# Altium project Quadrocopter.PrjPcb (part 1 of 2)
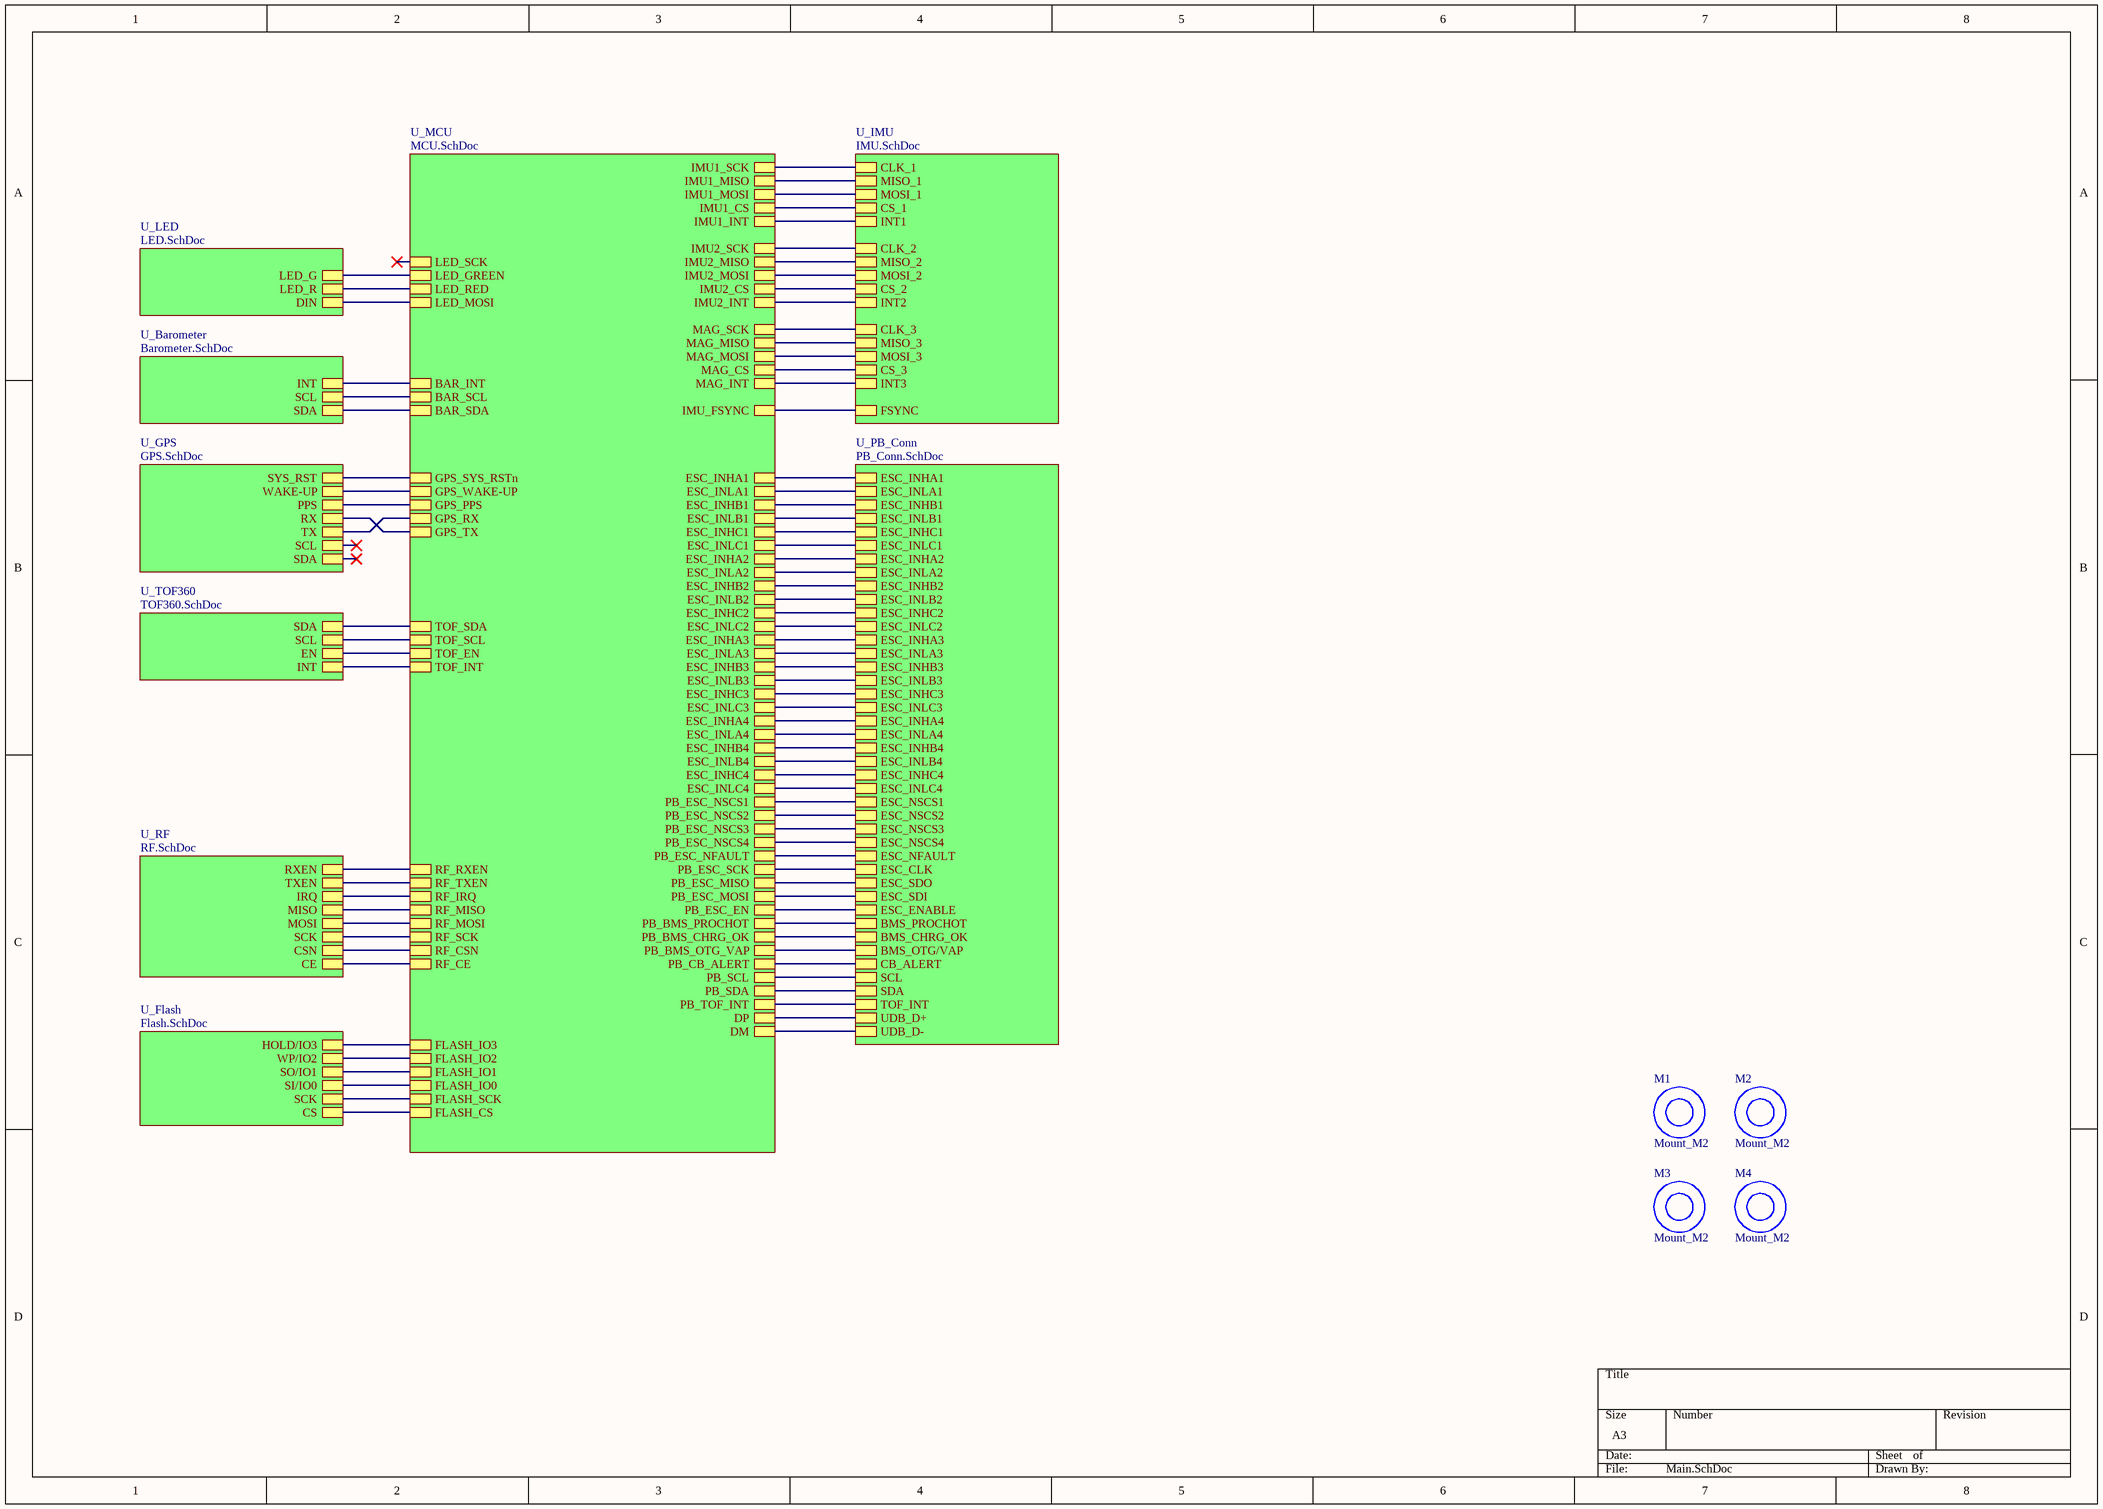
[diagram p0: Main.SchDoc]
11 sheets, 269 parts. Net scope: hierarchical (ports join the sheet entries above them; power ports are global).
Sheets:
  Main.SchDoc
    U_MCU = MCU.SchDoc
    U_IMU = IMU.SchDoc
    U_RF = RF.SchDoc
      U_NRF24l01 = NRF24l01.SchDoc
  ESC.SchDoc
  USB.SchDoc
  PDN.SchDoc
    U_PSU = PSU.SchDoc
    U_BMS = BMS.SchDoc
  ToF.SchDoc

## Sheet Main.SchDoc
size A3; SheetNumber: 1; SheetTotal: 12

### Parts
M1  Mount_M2  [Mount_M2]
M2  Mount_M2  [Mount_M2]
M3  Mount_M2  [Mount_M2]
M4  Mount_M2  [Mount_M2]

### Sub-sheets
U_Barometer = Barometer.SchDoc (file not in this document): SDA, SCL, INT
U_Flash = Flash.SchDoc (file not in this document): CS, SO/IO1, WP/IO2, HOLD/IO3, SCK, SI/IO0
U_GPS = GPS.SchDoc (file not in this document): SDA, SCL, TX, RX, PPS, WAKE-UP, SYS_RST
U_IMU = IMU.SchDoc: INT1, INT2, MISO_1, MOSI_1, CS_1, CLK_1, FSYNC, MISO_2, MOSI_2, CS_2, CLK_2, MOSI_3, CS_3, CLK_3, MISO_3, INT3
U_LED = LED.SchDoc (file not in this document): DIN, LED_R, LED_G
U_MCU = MCU.SchDoc: DP, DM, TOF_SDA, TOF_SCL, TOF_EN, TOF_INT, ESC_INHA1, ESC_INHA2, ESC_INHA3, ESC_INHA4, ESC_INHB1, ESC_INHC1, ESC_INHB2, ESC_INHB3, ESC_INHB4, ESC_INHC2, ESC_INHC3, ESC_INHC4, ESC_INLA1, ESC_INLB1, ESC_INLC1, ESC_INLA2, ESC_INLA3, ESC_INLA4, ESC_INLB2, ESC_INLB3, ESC_INLB4, ESC_INLC2, ESC_INLC3, ESC_INLC4, RF_IRQ, RF_CSN, RF_MOSI, RF_MISO, RF_SCK, RF_CE, RF_RXEN, RF_TXEN, PB_SCL, PB_SDA, PB_TOF_INT, PB_ESC_EN, PB_ESC_SCK, PB_ESC_MISO, PB_ESC_MOSI, PB_ESC_NSCS1, PB_ESC_NSCS2, PB_ESC_NSCS3, PB_ESC_NSCS4, PB_BMS_PROCHOT, PB_BMS_OTG_VAP, PB_BMS_CHRG_OK, PB_CB_ALERT, PB_ESC_NFAULT, FLASH_IO0, FLASH_IO1, FLASH_IO2, FLASH_IO3, FLASH_SCK, FLASH_CS, GPS_RX, GPS_TX, GPS_PPS, GPS_WAKE-UP, GPS_SYS_RSTn, BAR_SCL, BAR_SDA, BAR_INT, LED_MOSI, LED_SCK, LED_RED, LED_GREEN, IMU1_SCK, IMU1_MISO, IMU1_MOSI, IMU1_CS, IMU1_INT, IMU2_INT, IMU2_SCK, IMU2_MISO, IMU2_MOSI, IMU2_CS, MAG_SCK, MAG_MISO, MAG_MOSI, MAG_CS, MAG_INT, IMU_FSYNC
U_PB_Conn = PB_Conn.SchDoc (file not in this document): ESC_INLA1, ESC_INLB1, ESC_INLC1, ESC_INLA2, ESC_INLB2, ESC_INLC2, ESC_INLA3, ESC_INLB3, ESC_INLC3, ESC_INHA4, ESC_INLB4, ESC_INLC4, ESC_NSCS1, ESC_INHA1, ESC_INHB1, ESC_INHC1, ESC_INHA2, ESC_INHB2, ESC_INHC2, ESC_INHA3, ESC_INHB3, ESC_INHC3, ESC_INLA4, ESC_INHB4, ESC_INHC4, ESC_NSCS2, ESC_NSCS3, ESC_NSCS4, ESC_NFAULT, ESC_CLK, ESC_SDO, ESC_SDI, ESC_ENABLE, BMS_PROCHOT, BMS_CHRG_OK, BMS_OTG/VAP, CB_ALERT, SCL, SDA, TOF_INT, UDB_D+, UDB_D-
U_RF = RF.SchDoc: CE, CSN, SCK, MOSI, MISO, IRQ, TXEN, RXEN
U_TOF360 = TOF360.SchDoc (file not in this document): INT, SCL, SDA, EN

### Nets
I2C1_SCL: sheet U_MCU/TOF_SCL, sheet U_TOF360/SCL
I2C1_SDA: sheet U_MCU/TOF_SDA, sheet U_TOF360/SDA
SPI1_MISO: sheet U_MCU/IMU1_MISO, sheet U_IMU/MISO_1
SPI1_MOSI: sheet U_MCU/IMU1_MOSI, sheet U_IMU/MOSI_1
SPI1_SCK: sheet U_MCU/IMU1_SCK, sheet U_IMU/CLK_1
SPI5_MISO: sheet U_MCU/MAG_MISO, sheet U_IMU/MISO_3
SPI5_MOSI: sheet U_MCU/MAG_MOSI, sheet U_IMU/MOSI_3
SPI5_SCK: sheet U_MCU/MAG_SCK, sheet U_IMU/CLK_3
SPI6_MISO: sheet U_MCU/IMU2_MISO, sheet U_IMU/MISO_2
SPI6_MOSI: sheet U_MCU/IMU2_MOSI, sheet U_IMU/MOSI_2
SPI6_SCK: sheet U_MCU/IMU2_SCK, sheet U_IMU/CLK_2
TOF_EN: sheet U_MCU/TOF_EN, sheet U_TOF360/EN
TOF_INT: sheet U_MCU/TOF_INT, sheet U_TOF360/INT
NetIC1#1_5: sheet U_MCU/IMU1_CS, sheet U_IMU/CS_1
NetIC1#1_6: sheet U_MCU/IMU1_INT, sheet U_IMU/INT1
NetIC1#1_8: sheet U_MCU/IMU_FSYNC, sheet U_IMU/FSYNC
NetIC2#1_4: sheet U_MCU/IMU2_INT, sheet U_IMU/INT2
NetIC2#1_12: sheet U_MCU/IMU2_CS, sheet U_IMU/CS_2
NetIC3#1_1: sheet U_MCU/MAG_INT, sheet U_IMU/INT3
NetIC3#1_2: sheet U_MCU/MAG_CS, sheet U_IMU/CS_3
NetIC4#1_5: sheet U_MCU/LED_MOSI, sheet U_LED/DIN
NetIC4#1_10: sheet U_MCU/ESC_INHA1, sheet U_PB_Conn/ESC_INHA1
NetIC4#1_11: sheet U_MCU/ESC_INHB1, sheet U_PB_Conn/ESC_INHB1
NetIC4#1_12: sheet U_MCU/ESC_INHC1, sheet U_PB_Conn/ESC_INHC1
NetIC4#1_15: sheet U_MCU/PB_ESC_NFAULT, sheet U_PB_Conn/ESC_NFAULT
NetIC4#1_26: sheet U_MCU/LED_GREEN, sheet U_LED/LED_G
NetIC4#1_27: sheet U_MCU/LED_RED, sheet U_LED/LED_R
NetIC4#1_28: sheet U_MCU/PB_TOF_INT, sheet U_PB_Conn/TOF_INT
NetIC4#1_34: sheet U_MCU/ESC_INHA4, sheet U_PB_Conn/ESC_INHA4
NetIC4#1_35: sheet U_MCU/ESC_INHB4, sheet U_PB_Conn/ESC_INHB4
NetIC4#1_36: sheet U_MCU/ESC_INHC4, sheet U_PB_Conn/ESC_INHC4
NetIC4#1_42: sheet U_MCU/FLASH_IO3, sheet U_Flash/HOLD/IO3
NetIC4#1_43: sheet U_MCU/FLASH_IO2, sheet U_Flash/WP/IO2
NetIC4#1_45: sheet U_MCU/ESC_INLB4, sheet U_PB_Conn/ESC_INLB4
NetIC4#1_46: sheet U_MCU/FLASH_IO1, sheet U_Flash/SO/IO1
NetIC4#1_47: sheet U_MCU/FLASH_IO0, sheet U_Flash/SI/IO0
NetIC4#1_48: sheet U_MCU/FLASH_SCK, sheet U_Flash/SCK
NetIC4#1_49: sheet U_MCU/ESC_INLB2, sheet U_PB_Conn/ESC_INLB2
NetIC4#1_50: sheet U_MCU/ESC_INLB3, sheet U_PB_Conn/ESC_INLB3
NetIC4#1_53: sheet U_MCU/BAR_INT, sheet U_Barometer/INT
NetIC4#1_54: sheet U_MCU/BAR_SCL, sheet U_Barometer/SCL
NetIC4#1_55: sheet U_MCU/BAR_SDA, sheet U_Barometer/SDA
NetIC4#1_56: sheet U_MCU/ESC_INLA1, sheet U_PB_Conn/ESC_INLA1
NetIC4#1_57: sheet U_MCU/ESC_INLA2, sheet U_PB_Conn/ESC_INLA2
NetIC4#1_58: sheet U_MCU/ESC_INLA3, sheet U_PB_Conn/ESC_INLA3
NetIC4#1_59: sheet U_MCU/ESC_INLA4, sheet U_PB_Conn/ESC_INLA4
NetIC4#1_60: sheet U_MCU/ESC_INLB1, sheet U_PB_Conn/ESC_INLB1
NetIC4#1_64: sheet U_MCU/FLASH_CS, sheet U_Flash/CS
NetIC4#1_65: sheet U_MCU/ESC_INLC1, sheet U_PB_Conn/ESC_INLC1
NetIC4#1_66: sheet U_MCU/ESC_INLC2, sheet U_PB_Conn/ESC_INLC2
NetIC4#1_67: sheet U_MCU/ESC_INLC3, sheet U_PB_Conn/ESC_INLC3
NetIC4#1_68: sheet U_MCU/ESC_INLC4, sheet U_PB_Conn/ESC_INLC4
NetIC4#1_69: sheet U_MCU/PB_SCL, sheet U_PB_Conn/SCL
NetIC4#1_70: sheet U_MCU/PB_SDA, sheet U_PB_Conn/SDA
NetIC4#1_73: sheet U_MCU/PB_ESC_EN, sheet U_PB_Conn/ESC_ENABLE
NetIC4#1_74: sheet U_MCU/PB_ESC_SCK, sheet U_PB_Conn/ESC_CLK
NetIC4#1_75: sheet U_MCU/PB_ESC_MISO, sheet U_PB_Conn/ESC_SDO
NetIC4#1_76: sheet U_MCU/PB_ESC_MOSI, sheet U_PB_Conn/ESC_SDI
NetIC4#1_77: sheet U_MCU/PB_ESC_NSCS1, sheet U_PB_Conn/ESC_NSCS1
NetIC4#1_78: sheet U_MCU/PB_ESC_NSCS2, sheet U_PB_Conn/ESC_NSCS2
NetIC4#1_79: sheet U_MCU/PB_ESC_NSCS3, sheet U_PB_Conn/ESC_NSCS3
NetIC4#1_80: sheet U_MCU/PB_ESC_NSCS4, sheet U_PB_Conn/ESC_NSCS4
NetIC4#1_81: sheet U_MCU/ESC_INHA3, sheet U_PB_Conn/ESC_INHA3
NetIC4#1_82: sheet U_MCU/ESC_INHB3, sheet U_PB_Conn/ESC_INHB3
NetIC4#1_85: sheet U_MCU/ESC_INHC3, sheet U_PB_Conn/ESC_INHC3
NetIC4#1_86: sheet U_MCU/PB_BMS_PROCHOT, sheet U_PB_Conn/BMS_PROCHOT
NetIC4#1_87: sheet U_MCU/PB_BMS_OTG_VAP, sheet U_PB_Conn/BMS_OTG/VAP
NetIC4#1_91: sheet U_MCU/GPS_SYS_RSTn, sheet U_GPS/SYS_RST
NetIC4#1_92: sheet U_MCU/PB_CB_ALERT, sheet U_PB_Conn/CB_ALERT
NetIC4#1_93: sheet U_MCU/PB_BMS_CHRG_OK, sheet U_PB_Conn/BMS_CHRG_OK
NetIC4#1_96: sheet U_MCU/ESC_INHA2, sheet U_PB_Conn/ESC_INHA2
NetIC4#1_97: sheet U_MCU/ESC_INHB2, sheet U_PB_Conn/ESC_INHB2
NetIC4#1_98: sheet U_MCU/ESC_INHC2, sheet U_PB_Conn/ESC_INHC2
NetIC4#1_99: sheet U_MCU/GPS_PPS, sheet U_GPS/PPS
NetIC4#1_100: sheet U_MCU/GPS_WAKE-UP, sheet U_GPS/WAKE-UP
NetIC4#1_101: sheet U_MCU/GPS_TX, sheet U_GPS/RX
NetIC4#1_102: sheet U_MCU/GPS_RX, sheet U_GPS/TX
NetIC4#1_103: sheet U_MCU/DM, sheet U_PB_Conn/UDB_D-
NetIC4#1_104: sheet U_MCU/DP, sheet U_PB_Conn/UDB_D+
NetIC4#1_110: sheet U_MCU/RF_CE, sheet U_RF/CE
NetIC4#1_111: sheet U_MCU/RF_SCK, sheet U_RF/SCK
NetIC4#1_112: sheet U_MCU/RF_MISO, sheet U_RF/MISO
NetIC4#1_113: sheet U_MCU/RF_MOSI, sheet U_RF/MOSI
NetIC4#1_114: sheet U_MCU/RF_CSN, sheet U_RF/CSN
NetIC4#1_115: sheet U_MCU/RF_IRQ, sheet U_RF/IRQ
NetIC4#1_116: sheet U_MCU/RF_TXEN, sheet U_RF/TXEN
NetIC4#1_117: sheet U_MCU/RF_RXEN, sheet U_RF/RXEN

## Sheet MCU.SchDoc
size A2; SheetNumber: 3; SheetTotal: 12
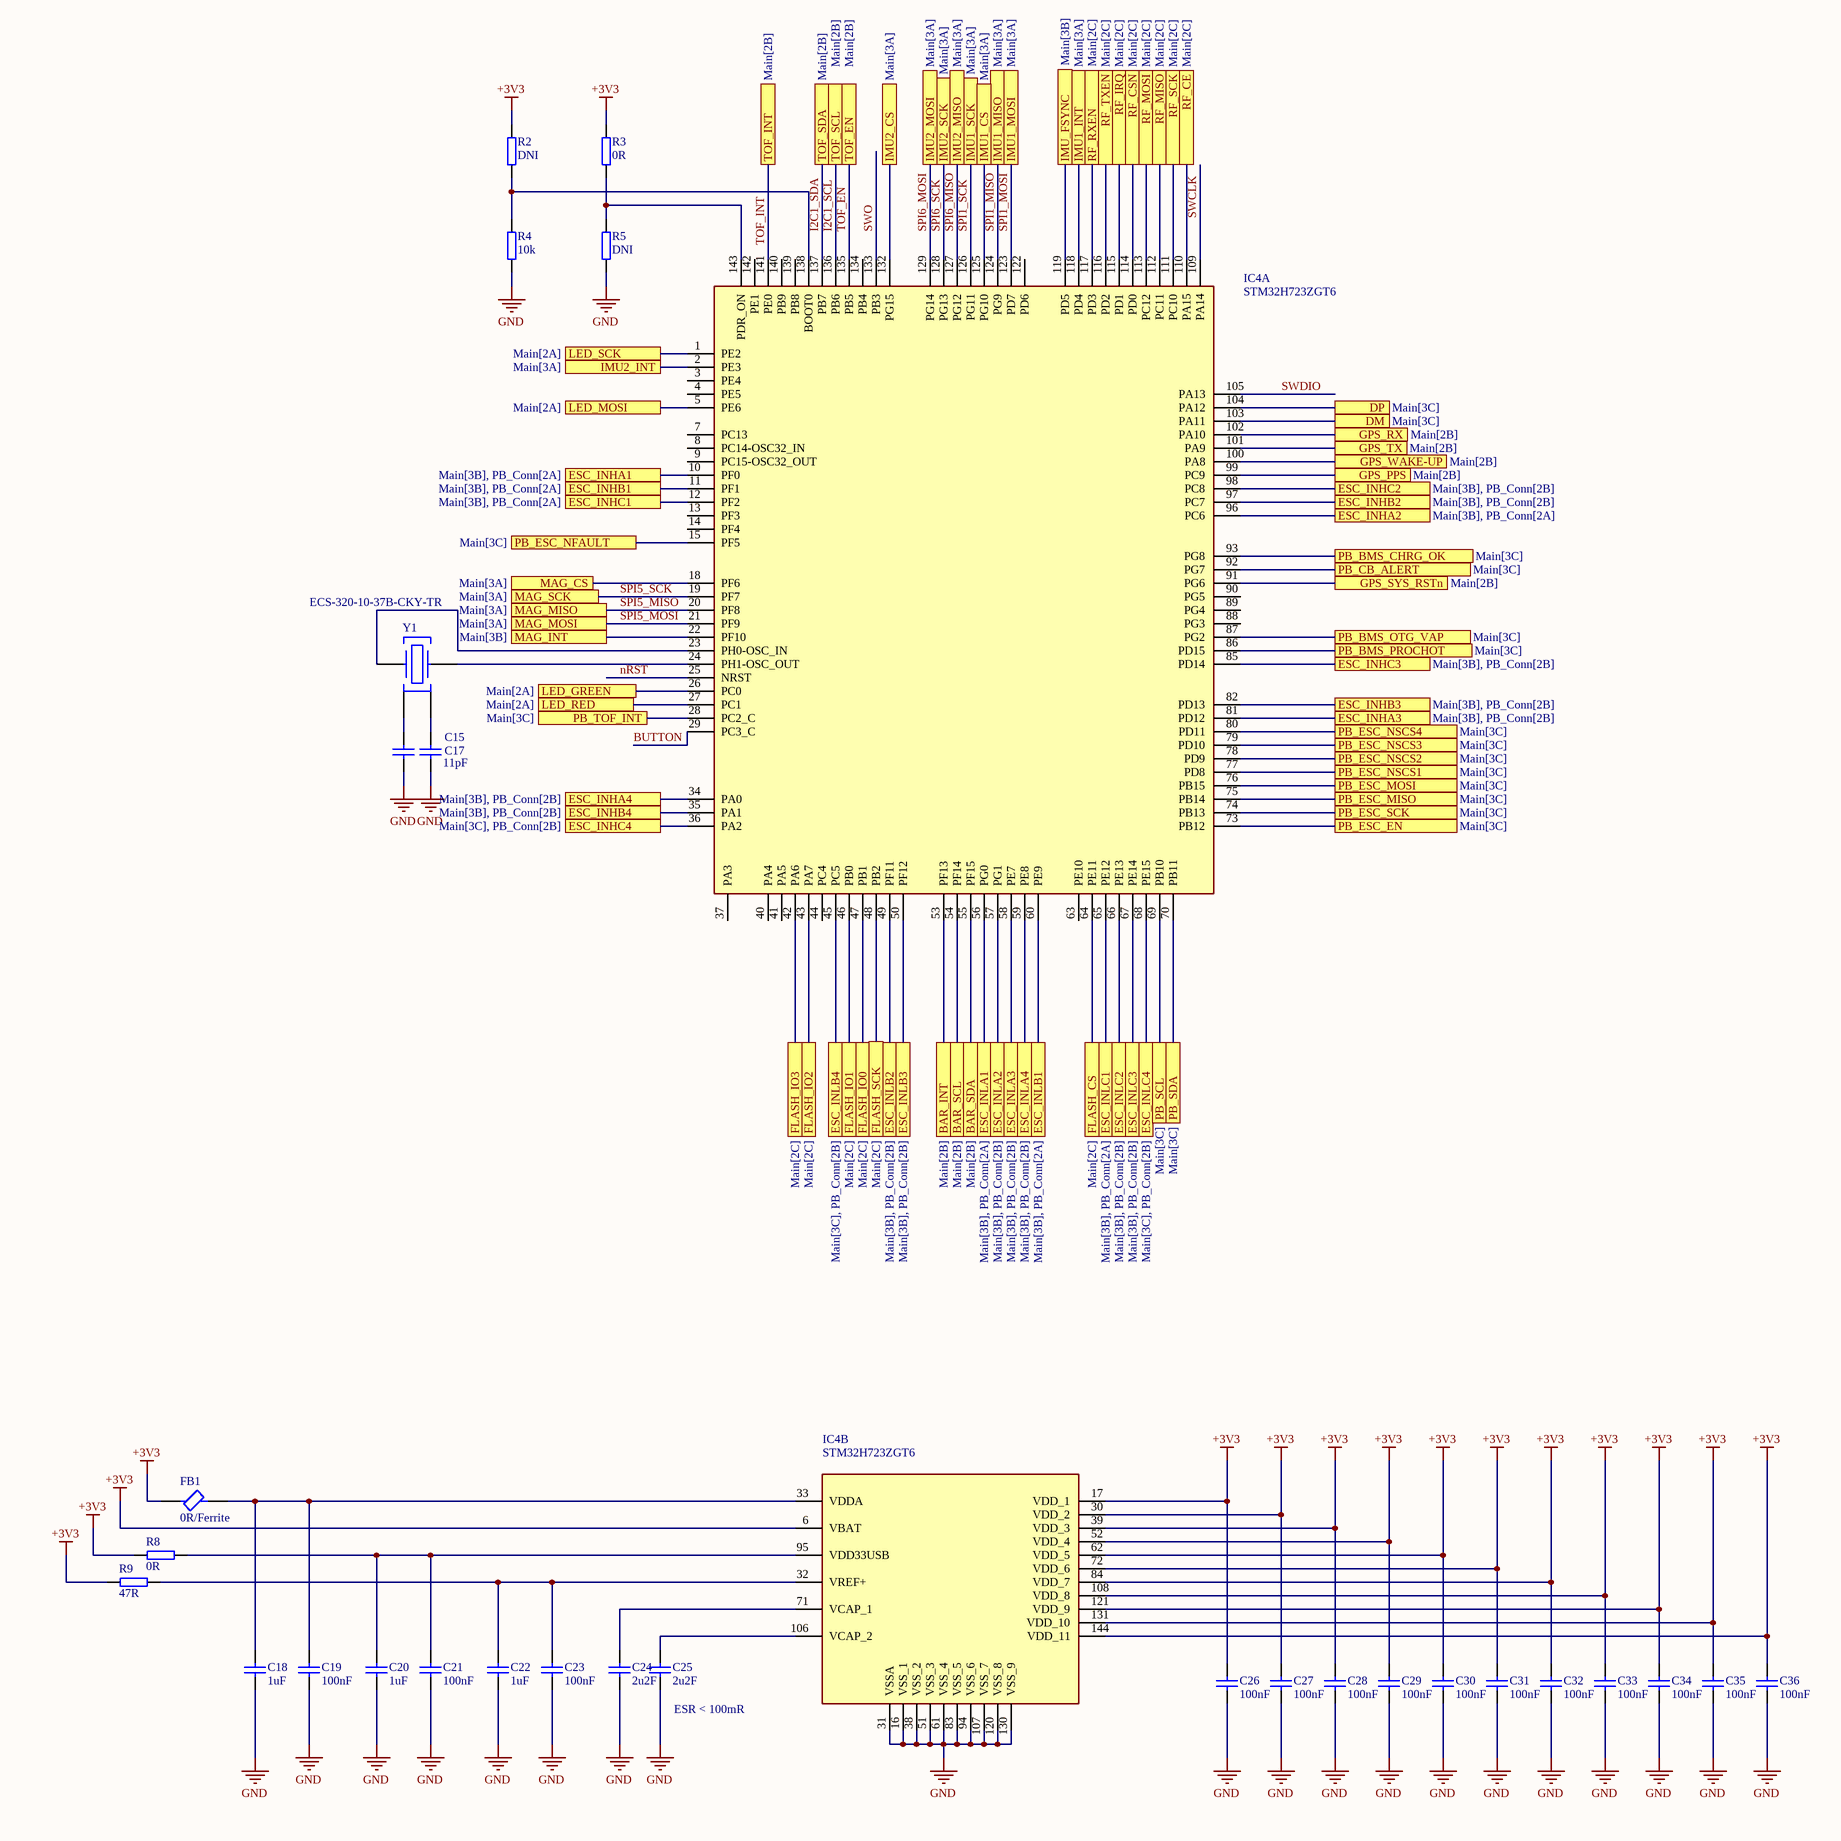
[diagram p1: MCU.SchDoc, left]
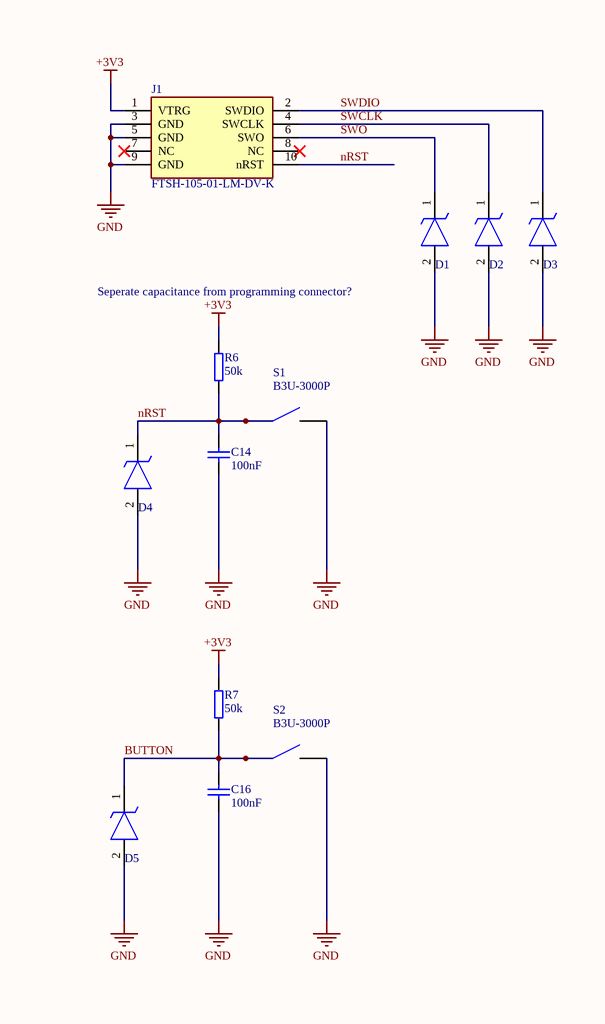
[diagram p2: MCU.SchDoc, right]

### Parts
(Parts that share a designator on the sheet are numbered #1, #2 ... from top to bottom, then left to right.)
C14#1  value 100nF  [CAP0402]  (hidden comment: Cap0402)
C15#1  Cap0402  [CAP0402]  (value not drawn)
C16#1  value 100nF  [CAP0402]  (hidden comment: Cap0402)
C17#1  value 11pF  [CAP0402]  (hidden comment: Cap0402)
C18#1  value 1uF  [CAP0603]  (hidden comment: Cap0603)
C19#1  value 100nF  [CAP0402]  (hidden comment: Cap0402)
C20#1  value 1uF  [CAP0603]  (hidden comment: Cap0603)
C21#1  value 100nF  [CAP0402]  (hidden comment: Cap0402)
C22#1  value 1uF  [CAP0603]  (hidden comment: Cap0603)
C23#1  value 100nF  [CAP0402]  (hidden comment: Cap0402)
C24#1  value 2u2F  [CAP0603]  (hidden comment: Cap0603)
C25#1  value 2u2F  [CAP0603]  (hidden comment: Cap0603)
C26#1  value 100nF  [CAP0402]  (hidden comment: Cap0402)
C27#1  value 100nF  [CAP0402]  (hidden comment: Cap0402)
C28#1  value 100nF  [CAP0402]  (hidden comment: Cap0402)
C29#1  value 100nF  [CAP0402]  (hidden comment: Cap0402)
C30#1  value 100nF  [CAP0402]  (hidden comment: Cap0402)
C31#1  value 100nF  [CAP0402]  (hidden comment: Cap0402)
C32#1  value 100nF  [CAP0402]  (hidden comment: Cap0402)
C33#1  value 100nF  [CAP0402]  (hidden comment: Cap0402)
C34#1  value 100nF  [CAP0402]  (hidden comment: Cap0402)
C35#1  value 100nF  [CAP0402]  (hidden comment: Cap0402)
C36#1  value 100nF  [CAP0402]  (hidden comment: Cap0402)
D1  D1213A-01LP4-7B  [D1213A01LP47B]  (value not drawn)
D2  D1213A-01LP4-7B  [D1213A01LP47B]  (value not drawn)
D3#1  D1213A-01LP4-7B  [D1213A01LP47B]  (value not drawn)
D4#1  D1213A-01LP4-7B  [D1213A01LP47B]  (value not drawn)
D5#1  D1213A-01LP4-7B  [D1213A01LP47B]  (value not drawn)
FB1#1  0R/Ferrite  [NFZ15SG152SN10B]
IC4#1  STM32H723ZGT6  [QFP50P2200X2200X160-144N]  (parts A,B of 2)
J1#1  FTSH-105-01-LM-DV-K  [FTSH-105-XX-YYY-DV-K]
R2#1  value DNI  [RES0402]  (hidden comment: Res0402)
R3#1  value 0R  [RES0402]  (hidden comment: Res0402)
R4#1  value 10k  [RES0402]  (hidden comment: Res0402)
R5#1  value DNI  [RES0402]  (hidden comment: Res0402)
R6#1  value 50k  [RES0402]  (hidden comment: Res0402)
R7#1  value 50k  [RES0402]  (hidden comment: Res0402)
R8#1  value 0R  [RES0402]  (hidden comment: Res0402)
R9#1  value 47R  [RES0402]  (hidden comment: Res0402)
S1  B3U-3000P  [B3U-1000P]
S2  B3U-3000P  [B3U-1000P]
Y1  ECS-320-10-37B-CKY-TR  [ECS3201037BCKYTR]

### Ports
BAR_INT (see Main[2B]), BAR_SCL (see Main[2B]), BAR_SDA (see Main[2B]), DM (see Main[3C]), DP (see Main[3C]), ESC_INHA1 (see Main[3B], PB_Conn[2A]), ESC_INHA2 (see Main[3B], PB_Conn[2A]), ESC_INHA3 (see Main[3B], PB_Conn[2B]), ESC_INHA4 (see Main[3B], PB_Conn[2B]), ESC_INHB1 (see Main[3B], PB_Conn[2A]), ESC_INHB2 (see Main[3B], PB_Conn[2B]), ESC_INHB3 (see Main[3B], PB_Conn[2B]), ESC_INHB4 (see Main[3B], PB_Conn[2B]), ESC_INHC1 (see Main[3B], PB_Conn[2A]), ESC_INHC2 (see Main[3B], PB_Conn[2B]), ESC_INHC3 (see Main[3B], PB_Conn[2B]), ESC_INHC4 (see Main[3C], PB_Conn[2B]), ESC_INLA1 (see Main[3B], PB_Conn[2A]), ESC_INLA2 (see Main[3B], PB_Conn[2B]), ESC_INLA3 (see Main[3B], PB_Conn[2B]), ESC_INLA4 (see Main[3B], PB_Conn[2B]), ESC_INLB1 (see Main[3B], PB_Conn[2A]), ESC_INLB2 (see Main[3B], PB_Conn[2B]), ESC_INLB3 (see Main[3B], PB_Conn[2B]), ESC_INLB4 (see Main[3C], PB_Conn[2B]), ESC_INLC1 (see Main[3B], PB_Conn[2A]), ESC_INLC2 (see Main[3B], PB_Conn[2B]), ESC_INLC3 (see Main[3B], PB_Conn[2B]), ESC_INLC4 (see Main[3C], PB_Conn[2B]), FLASH_CS (see Main[2C]), FLASH_IO0 (see Main[2C]), FLASH_IO1 (see Main[2C]), FLASH_IO2 (see Main[2C]), FLASH_IO3 (see Main[2C]), FLASH_SCK (see Main[2C]), GPS_PPS (see Main[2B]), GPS_RX (see Main[2B]), GPS_SYS_RSTn (see Main[2B]), GPS_TX (see Main[2B]), GPS_WAKE-UP (see Main[2B]), IMU1_CS (see Main[3A]), IMU1_INT (see Main[3A]), IMU1_MISO (see Main[3A]), IMU1_MOSI (see Main[3A]), IMU1_SCK (see Main[3A]), IMU2_CS (see Main[3A]), IMU2_INT (see Main[3A]), IMU2_MISO (see Main[3A]), IMU2_MOSI (see Main[3A]), IMU2_SCK (see Main[3A]), IMU_FSYNC (see Main[3B]), LED_GREEN (see Main[2A]), LED_MOSI (see Main[2A]), LED_RED (see Main[2A]), LED_SCK (see Main[2A]), MAG_CS (see Main[3A]), MAG_INT (see Main[3B]), MAG_MISO (see Main[3A]), MAG_MOSI (see Main[3A]), MAG_SCK (see Main[3A]), PB_BMS_CHRG_OK (see Main[3C]), PB_BMS_OTG_VAP (see Main[3C]), PB_BMS_PROCHOT (see Main[3C]), PB_CB_ALERT (see Main[3C]), PB_ESC_EN (see Main[3C]), PB_ESC_MISO (see Main[3C]), PB_ESC_MOSI (see Main[3C]), PB_ESC_NFAULT (see Main[3C]), PB_ESC_NSCS1 (see Main[3C]), PB_ESC_NSCS2 (see Main[3C]), PB_ESC_NSCS3 (see Main[3C]), PB_ESC_NSCS4 (see Main[3C]), PB_ESC_SCK (see Main[3C]), PB_SCL (see Main[3C]), PB_SDA (see Main[3C]), PB_TOF_INT (see Main[3C]), RF_CE (see Main[2C]), RF_CSN (see Main[2C]), RF_IRQ (see Main[2C]), RF_MISO (see Main[2C]), RF_MOSI (see Main[2C]), RF_RXEN (see Main[2C]), RF_SCK (see Main[2C]), RF_TXEN (see Main[2C]), TOF_EN (see Main[2B]), TOF_INT (see Main[2B]), TOF_SCL (see Main[2B]), TOF_SDA (see Main[2B])

### Nets
+3V3: C26#1.2 C27#1.2 C28#1.2 C29#1.2 C30#1.2 C31#1.2 C32#1.2 C33#1.2 C34#1.2 C35#1.2 C36#1.2 FB1#1.1 IC4#1.6(VBAT) IC4#1.17(VDD_1) IC4#1.30(VDD_2) IC4#1.39(VDD_3) IC4#1.52(VDD_4) IC4#1.62(VDD_5) IC4#1.72(VDD_6) IC4#1.84(VDD_7) IC4#1.108(VDD_8) IC4#1.121(VDD_9) IC4#1.131(VDD_10) IC4#1.144(VDD_11) J1#1.1(VTRG) R2#1.2 R3#1.2 R6#1.2 R7#1.2 R8#1.1 R9#1.1
GND: C14#1.1 C15#1.1 C16#1.1 C17#1.1 C18#1.1 C19#1.1 C20#1.1 C21#1.1 C22#1.1 C23#1.1 C24#1.1 C25#1.1 C26#1.1 C27#1.1 C28#1.1 C29#1.1 C30#1.1 C31#1.1 C32#1.1 C33#1.1 C34#1.1 C35#1.1 C36#1.1 D1.2(A) D2.2(A) D3#1.2(A) D4#1.2(A) D5#1.2(A) IC4#1.16(VSS_1) IC4#1.31(VSSA) IC4#1.38(VSS_2) IC4#1.51(VSS_3) IC4#1.61(VSS_4) IC4#1.83(VSS_5) IC4#1.94(VSS_6) IC4#1.107(VSS_7) IC4#1.120(VSS_8) IC4#1.130(VSS_9) J1#1.3(GND) J1#1.5(GND) J1#1.9(GND) R4#1.1 R5#1.1 S1.1 S2.1
BUTTON: C16#1.2 D5#1.1(K) IC4#1.29(PC3_C) R7#1.1 S2.2
I2C1_SCL: IC4#1.136(PB6) ; port TOF_SCL
I2C1_SDA: IC4#1.137(PB7) ; port TOF_SDA
nRST: C14#1.2 D4#1.1(K) IC4#1.25(NRST) J1#1.10(nRST) R6#1.1 S1.2
SPI1_MISO: IC4#1.124(PG9) ; port IMU1_MISO
SPI1_MOSI: IC4#1.123(PD7) ; port IMU1_MOSI
SPI1_SCK: IC4#1.126(PG11) ; port IMU1_SCK
SPI5_MISO: IC4#1.20(PF8) ; port MAG_MISO
SPI5_MOSI: IC4#1.21(PF9) ; port MAG_MOSI
SPI5_SCK: IC4#1.19(PF7) ; port MAG_SCK
SPI6_MISO: IC4#1.127(PG12) ; port IMU2_MISO
SPI6_MOSI: IC4#1.129(PG14) ; port IMU2_MOSI
SPI6_SCK: IC4#1.128(PG13) ; port IMU2_SCK
SWCLK: D2.1(K) IC4#1.109(PA14) J1#1.4(SWCLK)
SWDIO: D3#1.1(K) IC4#1.105(PA13) J1#1.2(SWDIO)
SWO: D1.1(K) IC4#1.133(PB3) J1#1.6(SWO)
TOF_EN: IC4#1.135(PB5) ; port TOF_EN
TOF_INT: IC4#1.141(PE0) ; port TOF_INT
NetC15#1_2: C15#1.2 Y1.4(GND_2)
NetC17#1_2: C17#1.2 Y1.2(GND_1)
NetC18#1_2: C18#1.2 C19#1.2 FB1#1.2 IC4#1.33(VDDA)
NetC20#1_2: C20#1.2 C21#1.2 IC4#1.95(VDD33USB) R8#1.2
NetC22#1_2: C22#1.2 C23#1.2 IC4#1.32(VREF+) R9#1.2
NetC24#1_2: C24#1.2 IC4#1.71(VCAP_1)
NetC25#1_2: C25#1.2 IC4#1.106(VCAP_2)
NetIC1#1_5: IC4#1.125(PG10) ; port IMU1_CS
NetIC1#1_6: IC4#1.118(PD4) ; port IMU1_INT
NetIC1#1_8: IC4#1.119(PD5) ; port IMU_FSYNC
NetIC2#1_4: IC4#1.2(PE3) ; port IMU2_INT
NetIC2#1_12: IC4#1.132(PG15) ; port IMU2_CS
NetIC3#1_1: IC4#1.22(PF10) ; port MAG_INT
NetIC3#1_2: IC4#1.18(PF6) ; port MAG_CS
NetIC4#1_1: IC4#1.1(PE2) ; port LED_SCK
NetIC4#1_5: IC4#1.5(PE6) ; port LED_MOSI
NetIC4#1_10: IC4#1.10(PF0) ; port ESC_INHA1
NetIC4#1_11: IC4#1.11(PF1) ; port ESC_INHB1
NetIC4#1_12: IC4#1.12(PF2) ; port ESC_INHC1
NetIC4#1_15: IC4#1.15(PF5) ; port PB_ESC_NFAULT
NetIC4#1_23: IC4#1.23(PH0-OSC_IN) Y1.1(CRYSTAL_1)
NetIC4#1_24: IC4#1.24(PH1-OSC_OUT) Y1.3(CRYSTAL_2)
NetIC4#1_26: IC4#1.26(PC0) ; port LED_GREEN
NetIC4#1_27: IC4#1.27(PC1) ; port LED_RED
NetIC4#1_28: IC4#1.28(PC2_C) ; port PB_TOF_INT
NetIC4#1_34: IC4#1.34(PA0) ; port ESC_INHA4
NetIC4#1_35: IC4#1.35(PA1) ; port ESC_INHB4
NetIC4#1_36: IC4#1.36(PA2) ; port ESC_INHC4
NetIC4#1_42: IC4#1.42(PA6) ; port FLASH_IO3
NetIC4#1_43: IC4#1.43(PA7) ; port FLASH_IO2
NetIC4#1_45: IC4#1.45(PC5) ; port ESC_INLB4
NetIC4#1_46: IC4#1.46(PB0) ; port FLASH_IO1
NetIC4#1_47: IC4#1.47(PB1) ; port FLASH_IO0
NetIC4#1_48: IC4#1.48(PB2) ; port FLASH_SCK
NetIC4#1_49: IC4#1.49(PF11) ; port ESC_INLB2
NetIC4#1_50: IC4#1.50(PF12) ; port ESC_INLB3
NetIC4#1_53: IC4#1.53(PF13) ; port BAR_INT
NetIC4#1_54: IC4#1.54(PF14) ; port BAR_SCL
NetIC4#1_55: IC4#1.55(PF15) ; port BAR_SDA
NetIC4#1_56: IC4#1.56(PG0) ; port ESC_INLA1
NetIC4#1_57: IC4#1.57(PG1) ; port ESC_INLA2
NetIC4#1_58: IC4#1.58(PE7) ; port ESC_INLA3
NetIC4#1_59: IC4#1.59(PE8) ; port ESC_INLA4
NetIC4#1_60: IC4#1.60(PE9) ; port ESC_INLB1
NetIC4#1_64: IC4#1.64(PE11) ; port FLASH_CS
NetIC4#1_65: IC4#1.65(PE12) ; port ESC_INLC1
NetIC4#1_66: IC4#1.66(PE13) ; port ESC_INLC2
NetIC4#1_67: IC4#1.67(PE14) ; port ESC_INLC3
NetIC4#1_68: IC4#1.68(PE15) ; port ESC_INLC4
NetIC4#1_69: IC4#1.69(PB10) ; port PB_SCL
NetIC4#1_70: IC4#1.70(PB11) ; port PB_SDA
NetIC4#1_73: IC4#1.73(PB12) ; port PB_ESC_EN
NetIC4#1_74: IC4#1.74(PB13) ; port PB_ESC_SCK
NetIC4#1_75: IC4#1.75(PB14) ; port PB_ESC_MISO
NetIC4#1_76: IC4#1.76(PB15) ; port PB_ESC_MOSI
NetIC4#1_77: IC4#1.77(PD8) ; port PB_ESC_NSCS1
NetIC4#1_78: IC4#1.78(PD9) ; port PB_ESC_NSCS2
NetIC4#1_79: IC4#1.79(PD10) ; port PB_ESC_NSCS3
NetIC4#1_80: IC4#1.80(PD11) ; port PB_ESC_NSCS4
NetIC4#1_81: IC4#1.81(PD12) ; port ESC_INHA3
NetIC4#1_82: IC4#1.82(PD13) ; port ESC_INHB3
NetIC4#1_85: IC4#1.85(PD14) ; port ESC_INHC3
NetIC4#1_86: IC4#1.86(PD15) ; port PB_BMS_PROCHOT
NetIC4#1_87: IC4#1.87(PG2) ; port PB_BMS_OTG_VAP
NetIC4#1_91: IC4#1.91(PG6) ; port GPS_SYS_RSTn
NetIC4#1_92: IC4#1.92(PG7) ; port PB_CB_ALERT
NetIC4#1_93: IC4#1.93(PG8) ; port PB_BMS_CHRG_OK
NetIC4#1_96: IC4#1.96(PC6) ; port ESC_INHA2
NetIC4#1_97: IC4#1.97(PC7) ; port ESC_INHB2
NetIC4#1_98: IC4#1.98(PC8) ; port ESC_INHC2
NetIC4#1_99: IC4#1.99(PC9) ; port GPS_PPS
NetIC4#1_100: IC4#1.100(PA8) ; port GPS_WAKE-UP
NetIC4#1_101: IC4#1.101(PA9) ; port GPS_TX
NetIC4#1_102: IC4#1.102(PA10) ; port GPS_RX
NetIC4#1_103: IC4#1.103(PA11) ; port DM
NetIC4#1_104: IC4#1.104(PA12) ; port DP
NetIC4#1_110: IC4#1.110(PA15) ; port RF_CE
NetIC4#1_111: IC4#1.111(PC10) ; port RF_SCK
NetIC4#1_112: IC4#1.112(PC11) ; port RF_MISO
NetIC4#1_113: IC4#1.113(PC12) ; port RF_MOSI
NetIC4#1_114: IC4#1.114(PD0) ; port RF_CSN
NetIC4#1_115: IC4#1.115(PD1) ; port RF_IRQ
NetIC4#1_116: IC4#1.116(PD2) ; port RF_TXEN
NetIC4#1_117: IC4#1.117(PD3) ; port RF_RXEN
NetIC4#1_138: IC4#1.138(BOOT0) R2#1.1 R4#1.2
NetIC4#1_143: IC4#1.143(PDR_ON) R3#1.1 R5#1.2

Not connected (* = marked no-connect by the designer): IC4#1 3(PE4) 4(PE5) 7(PC13) 8(PC14-OSC32_IN) 9(PC15-OSC32_OUT) 13(PF3) 14(PF4) 37(PA3) 40(PA4) 41(PA5) 44(PC4) 63(PE10) 88(PG3) 89(PG4) 90(PG5) 122(PD6) 134(PB4) 139(PB8) 140(PB9) 142(PE1); J1#1 7(NC)* 8(NC)*

### Notes on the sheet
- Seperate capacitance from programming connector?
- (near C25#1) ESR < 100mR

### Library data of the parts
C14#1 C16#1 C17#1 C19#1 C21#1 C23#1 C26#1 C27#1 C28#1 C29#1 C30#1 C31#1 C32#1 C33#1 C34#1 C35#1 C36#1 = Cap0402: Voltage: 50V
C15#1 = Cap0402: Voltage: 50V; Value: 11pF
C18#1 C20#1 C22#1 C24#1 C25#1 = Cap0603: Voltage: 50V
D1 D2 D3#1 D4#1 D5#1 = D1213A-01LP4-7B: TVS Diode (Uni-directional); Manufacturer_Name: Diodes Incorporated; Datasheet Link: https://www.diodes.com/assets/Datasheets/D1213A-01LP4.pdf; Height: 0.4mm; Manufacturer_Part_Number: D1213A-01LP4-7B; Mouser Part Number: 621-D1213A-01LP4-7B; Mouser Price/Stock: https://www.mouser.co.uk/ProductDetail/Diodes-Incorporated/D1213A-01LP4-7B?qs=gfe7vQ8txpVKfG5NOSOvfA%3D%3D; Arrow Part Number: D1213A-01LP4-7B; Arrow Price/Stock: https://www.arrow.com/en/products/d1213a-01lp4-7b/diodes-incorporated?region=europe
FB1#1 = BLM15PE471SH1D: Ferrite Bead; Manufacturer_Name: Murata Electronics; Datasheet Link: https://www.murata.com/en-global/products/productdetail.aspx?cate=luNoiseSupprFilteChipFerriBead&partno=BLM15PE471SH1%23; Height: 0.55mm; Manufacturer_Part_Number: BLM15PE471SH1D; Mouser Part Number: 81-BLM15PE471SH1D; Mouser Price/Stock: https://www.mouser.co.uk/ProductDetail/Murata-Electronics/BLM15PE471SH1D?qs=DRkmTr78QATAY5qAVx1hGA%3D%3D
IC4#1 = STM32H723ZGT6: Integrated Circuit; Manufacturer_Name: STMicroelectronics; Datasheet Link: https://www.mouser.cn/datasheet/2/389/stm32h723zg-1893346.pdf; Height: 1.6mm; Manufacturer_Part_Number: STM32H723ZGT6; Mouser Part Number: 511-STM32H723ZGT6; Mouser Price/Stock: https://www.mouser.co.uk/ProductDetail/STMicroelectronics/STM32H723ZGT6?qs=sPbYRqrBIVkPaOxQT7wG%252BA%3D%3D; Arrow Part Number: STM32H723ZGT6; Arrow Price/Stock: https://www.arrow.com/en/products/stm32h723zgt6/stmicroelectronics?region=nac
J1#1 = FTSH-105-01-LM-DV-K: Connector; Manufacturer_Name: SAMTEC; Datasheet Link: http://suddendocs.samtec.com/prints/ftsh-1xx-xx-xxx-dv-xxx-xxx-mkt.pdf; Manufacturer_Part_Number: FTSH-105-01-LM-DV-K; Mouser Part Number: 200-FTSH10501LMDVK; Mouser Price/Stock: https://www.mouser.co.uk/ProductDetail/Samtec/FTSH-105-01-LM-DV-K?qs=Cqqh%252BS766wkgt1n7b4Yb6g%3D%3D; Arrow Part Number: FTSH-105-01-LM-DV-K; Arrow Price/Stock: https://www.arrow.com/en/products/ftsh-105-01-lm-dv-k/samtec?utm_currency=USD&region=nac
S1 S2 = B3U-3000P: Switch; Manufacturer_Name: Omron Electronics; Datasheet Link: http://omronfs.omron.com/en_US/ecb/products/pdf/en-b3u.pdf; Manufacturer_Part_Number: B3U-3000P; Mouser Part Number: 653-B3U-3000P; Mouser Price/Stock: https://www.mouser.co.uk/ProductDetail/Omron-Electronics/B3U-3000P?qs=AO7BQMcsEu4un9I7hS23xg%3D%3D; Arrow Part Number: B3U-3000P; Arrow Price/Stock: https://www.arrow.com/en/products/b3u-3000p/omron?region=nac
Y1 = ECS-320-10-37B-CKY-TR: Crystal or Oscillator; Manufacturer_Name: ECS; Datasheet Link: https://ecsxtal.com/store/pdf/ECX-1637B.pdf; Height: 0.5mm; Manufacturer_Part_Number: ECS-320-10-37B-CKY-TR; Mouser Part Number: 520-320-10-37B-CKYT; Mouser Price/Stock: https://www.mouser.co.uk/ProductDetail/ECS/ECS-320-10-37B-CKY-TR?qs=l7cgNqFNU1gltxVt%2FwcX%252Bw%3D%3D; Arrow Part Number: ECS-320-10-37B-CKY-TR; Arrow Price/Stock: https://www.arrow.com/en/products/ecs-320-10-37b-cky-tr/ecs-international?region=nac

## Sheet IMU.SchDoc
size A2 portrait; SheetNumber: 3; SheetTotal: 11
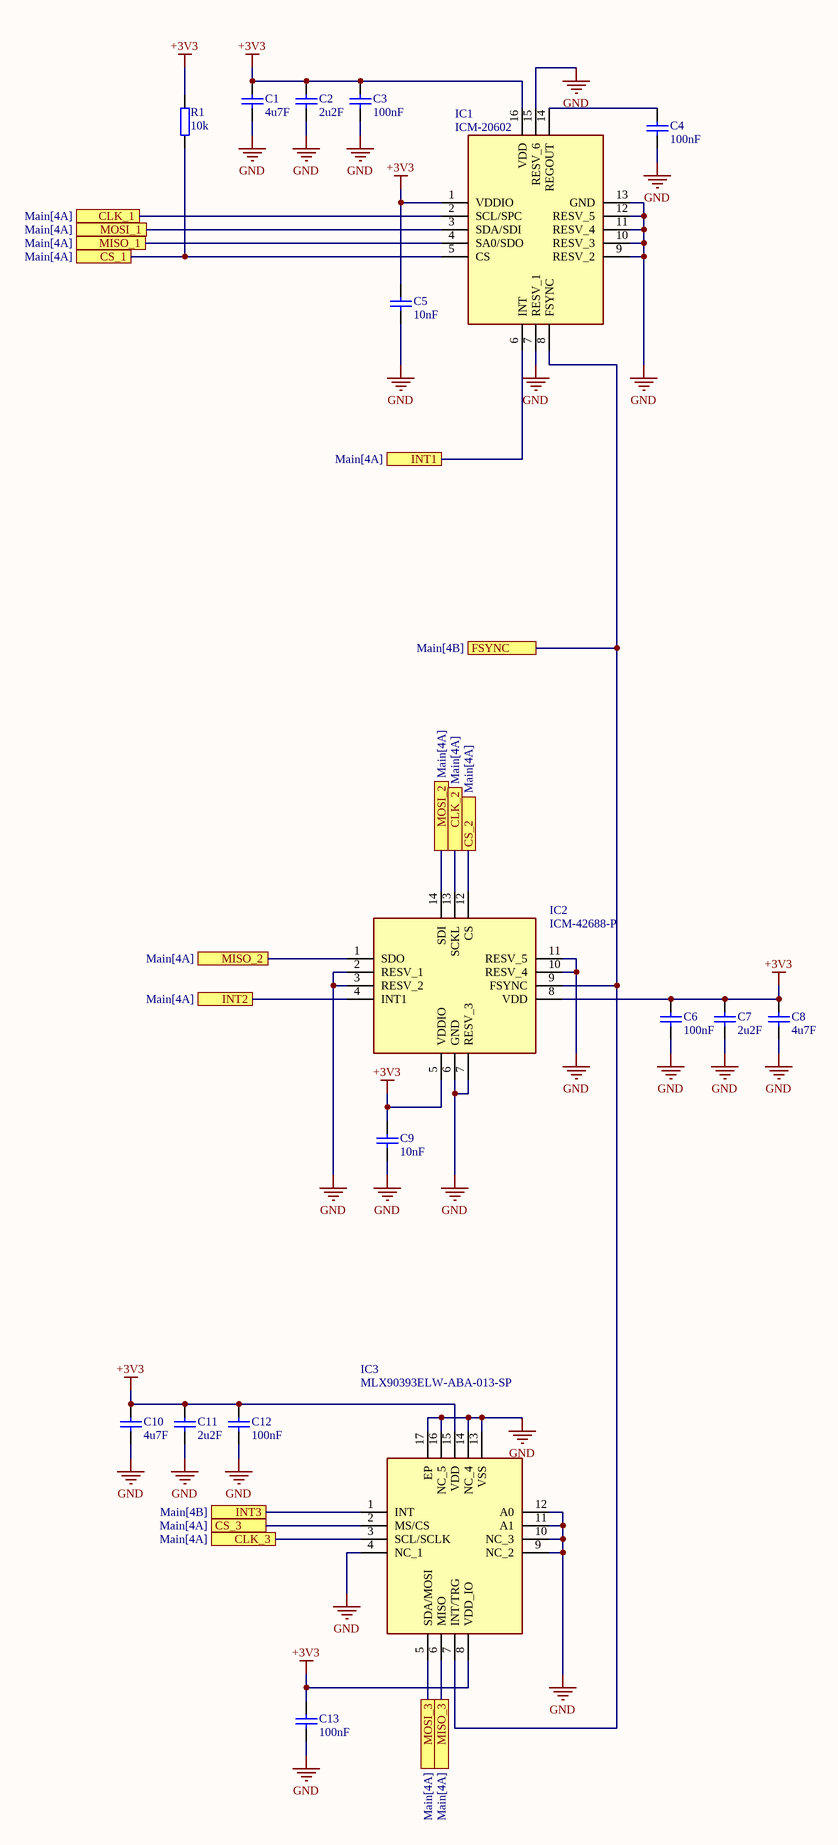
[diagram p3: IMU.SchDoc]

### Parts
(Parts that share a designator on the sheet are numbered #1, #2 ... from top to bottom, then left to right.)
C1#1  value 4u7F  [CAP0805]  (hidden comment: Cap0805)
C2#1  value 2u2F  [CAP0603]  (hidden comment: Cap0603)
C3#1  value 100nF  [CAP0402]  (hidden comment: Cap0402)
C4#1  value 100nF  [CAP0402]  (hidden comment: Cap0402)
C5#1  value 10nF  [CAP0402]  (hidden comment: Cap0402)
C6#1  value 100nF  [CAP0402]  (hidden comment: Cap0402)
C7#1  value 2u2F  [CAP0603]  (hidden comment: Cap0603)
C8#1  value 4u7F  [CAP0805]  (hidden comment: Cap0805)
C9#1  value 10nF  [CAP0402]  (hidden comment: Cap0402)
C10#1  value 4u7F  [CAP0805]  (hidden comment: Cap0805)
C11#1  value 2u2F  [CAP0603]  (hidden comment: Cap0603)
C12  value 100nF  [CAP0402]  (hidden comment: Cap0402)
C13#1  value 100nF  [CAP0402]  (hidden comment: Cap0402)
IC1#1  ICM-20602  [IAM20680HP]
IC2#1  ICM-42688-P  [IIM42352]
IC3#1  MLX90393ELW-ABA-013-SP  [QFN50P300X300X100-17N-D]
R1#1  value 10k  [RES0402]  (hidden comment: Res0402)

### Ports
CLK_1 (see Main[4A]), CLK_2 (see Main[4A]), CLK_3 (see Main[4A]), CS_1 (see Main[4A]), CS_2 (see Main[4A]), CS_3 (see Main[4A]), FSYNC (see Main[4B]), INT1 (see Main[4A]), INT2 (see Main[4A]), INT3 (see Main[4B]), MISO_1 (see Main[4A]), MISO_2 (see Main[4A]), MISO_3 (see Main[4A]), MOSI_1 (see Main[4A]), MOSI_2 (see Main[4A]), MOSI_3 (see Main[4A])

### Nets
+3V3: C1#1.2 C2#1.2 C3#1.2 C5#1.2 C6#1.2 C7#1.2 C8#1.2 C9#1.2 C10#1.2 C11#1.2 C12.2 C13#1.2 IC1#1.1(VDDIO) IC1#1.16(VDD) IC2#1.5(VDDIO) IC2#1.8(VDD) IC3#1.8(VDD_IO) IC3#1.15(VDD) R1#1.2
GND: C1#1.1 C2#1.1 C3#1.1 C4#1.1 C5#1.1 C6#1.1 C7#1.1 C8#1.1 C9#1.1 C10#1.1 C11#1.1 C12.1 C13#1.1 IC1#1.7(RESV_1) IC1#1.9(RESV_2) IC1#1.10(RESV_3) IC1#1.11(RESV_4) IC1#1.12(RESV_5) IC1#1.13(GND) IC1#1.15(RESV_6) IC2#1.2(RESV_1) IC2#1.3(RESV_2) IC2#1.6(GND) IC2#1.7(RESV_3) IC2#1.10(RESV_4) IC2#1.11(RESV_5) IC3#1.4(NC_1) IC3#1.9(NC_2) IC3#1.10(NC_3) IC3#1.11(A1) IC3#1.12(A0) IC3#1.13(VSS) IC3#1.14(NC_4) IC3#1.16(NC_5) IC3#1.17(EP)
SPI1_MISO: IC1#1.4(SA0/SDO) ; port MISO_1
SPI1_MOSI: IC1#1.3(SDA/SDI) ; port MOSI_1
SPI1_SCK: IC1#1.2(SCL/SPC) ; port CLK_1
SPI5_MISO: IC3#1.6(MISO) ; port MISO_3
SPI5_MOSI: IC3#1.5(SDA/MOSI) ; port MOSI_3
SPI5_SCK: IC3#1.3(SCL/SCLK) ; port CLK_3
SPI6_MISO: IC2#1.1(SDO) ; port MISO_2
SPI6_MOSI: IC2#1.14(SDI) ; port MOSI_2
SPI6_SCK: IC2#1.13(SCKL) ; port CLK_2
NetC4#1_2: C4#1.2 IC1#1.14(REGOUT)
NetIC1#1_5: IC1#1.5(CS) R1#1.1 ; port CS_1
NetIC1#1_6: IC1#1.6(INT) ; port INT1
NetIC1#1_8: IC1#1.8(FSYNC) IC2#1.9(FSYNC) IC3#1.7(INT/TRG) ; port FSYNC
NetIC2#1_4: IC2#1.4(INT1) ; port INT2
NetIC2#1_12: IC2#1.12(CS) ; port CS_2
NetIC3#1_1: IC3#1.1(INT) ; port INT3
NetIC3#1_2: IC3#1.2(MS/CS) ; port CS_3

### Library data of the parts
C1#1 C8#1 C10#1 = Cap0805: Voltage: 35V
C2#1 C7#1 C11#1 = Cap0603: Voltage: 50V
C3#1 C4#1 C5#1 C6#1 C9#1 C12 C13#1 = Cap0402: Voltage: 50V
IC1#1 = ICM-20602: Integrated Circuit; Manufacturer_Name: TDK; Datasheet Link: https://3cfeqx1hf82y3xcoull08ihx-wpengine.netdna-ssl.com/wp-content/uploads/2021/03/DS-000135-ICG-20660-TYP-v1.2.pdf; Manufacturer_Part_Number: ICM-20602; Mouser Part Number: 410-ICM-20602; Mouser Price/Stock: https://www.mouser.co.uk/ProductDetail/TDK-InvenSense/ICM-20602?qs=u4fy%2FsgLU9NtDChFbqTxBA%3D%3D; Arrow Part Number: ICM-20602; Arrow Price/Stock: https://www.arrow.com/en/products/icm-20602/invensense?utm_currency=USD&region=nac
IC2#1 = ICM-42688-P: Integrated Circuit; Manufacturer_Name: TDK; Datasheet Link: https://3cfeqx1hf82y3xcoull08ihx-wpengine.netdna-ssl.com/wp-content/uploads/2021/06/DS-000347-ICM-42688-P-v1.5.pdf; Manufacturer_Part_Number: ICM-42688-P; Mouser Part Number: 410-ICM-42688-P; Mouser Price/Stock: https://www.mouser.co.uk/ProductDetail/TDK-InvenSense/ICM-42688-P?qs=OlC7AqGiEDk8QrNAV728zw%3D%3D; Arrow Part Number: ICM-42688-P; Arrow Price/Stock: https://www.arrow.com/en/products/icm-42688-p/invensense?utm_currency=USD&region=nac
IC3#1 = MLX90393ELW-ABA-013-SP: Integrated Circuit; Manufacturer_Name: Melexis; Datasheet Link: https://www.melexis.com/-/media/files/documents/datasheets/mlx90393-datasheet-melexis.pdf; Height: 1mm; Manufacturer_Part_Number: MLX90393ELW-ABA-013-SP; Mouser Part Number: 482-90393ELWABA013SP; Mouser Price/Stock: https://www.mouser.co.uk/ProductDetail/Melexis/MLX90393ELW-ABA-013-SP?qs=4pzlT8jjbhe5W8hWOSw65g%3D%3D; Arrow Part Number: MLX90393ELW-ABA-013-SP; Arrow Price/Stock: https://www.arrow.com/en/products/mlx90393elw-aba-013-sp/melexis?utm_currency=USD&region=nac

## Sheet RF.SchDoc
size A4; SheetNumber: 5; SheetTotal: 11
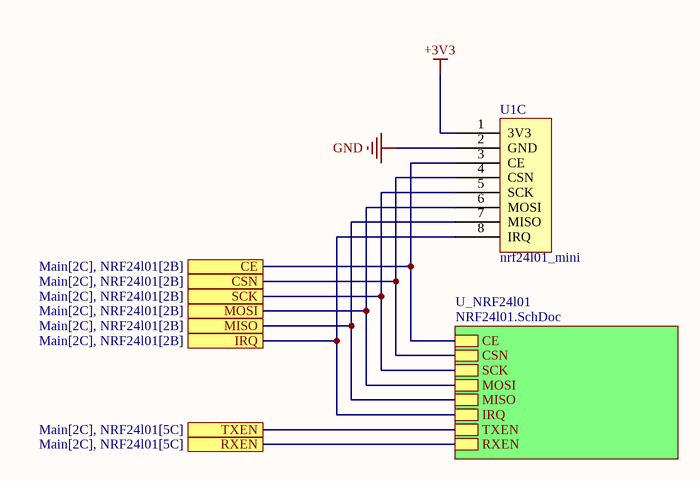
[diagram p4: RF.SchDoc]

### Parts
U1  nrf24l01_mini  [nr24l01_mini]  (part C of 3)

### Sub-sheets
U_NRF24l01 = NRF24l01.SchDoc: CE, CSN, SCK, MOSI, MISO, IRQ, TXEN, RXEN

### Ports
CE (see Main[2C], NRF24l01[2B]), CSN (see Main[2C], NRF24l01[2B]), IRQ (see Main[2C], NRF24l01[2B]), MISO (see Main[2C], NRF24l01[2B]), MOSI (see Main[2C], NRF24l01[2B]), RXEN (see Main[2C], NRF24l01[5C]), SCK (see Main[2C], NRF24l01[2B]), TXEN (see Main[2C], NRF24l01[5C])

### Nets
+3V3: U1.1(3V3)
GND: U1.2(GND)
NetIC4#1_110: U1.3(CE) ; port CE, sheet U_NRF24l01/CE
NetIC4#1_111: U1.5(SCK) ; port SCK, sheet U_NRF24l01/SCK
NetIC4#1_112: U1.7(MISO) ; port MISO, sheet U_NRF24l01/MISO
NetIC4#1_113: U1.6(MOSI) ; port MOSI, sheet U_NRF24l01/MOSI
NetIC4#1_114: U1.4(CSN) ; port CSN, sheet U_NRF24l01/CSN
NetIC4#1_115: U1.8(IRQ) ; port IRQ, sheet U_NRF24l01/IRQ
NetIC4#1_116: port TXEN, sheet U_NRF24l01/TXEN
NetIC4#1_117: port RXEN, sheet U_NRF24l01/RXEN

## Sheet NRF24l01.SchDoc
size A2; SheetNumber: 5; SheetTotal: 12
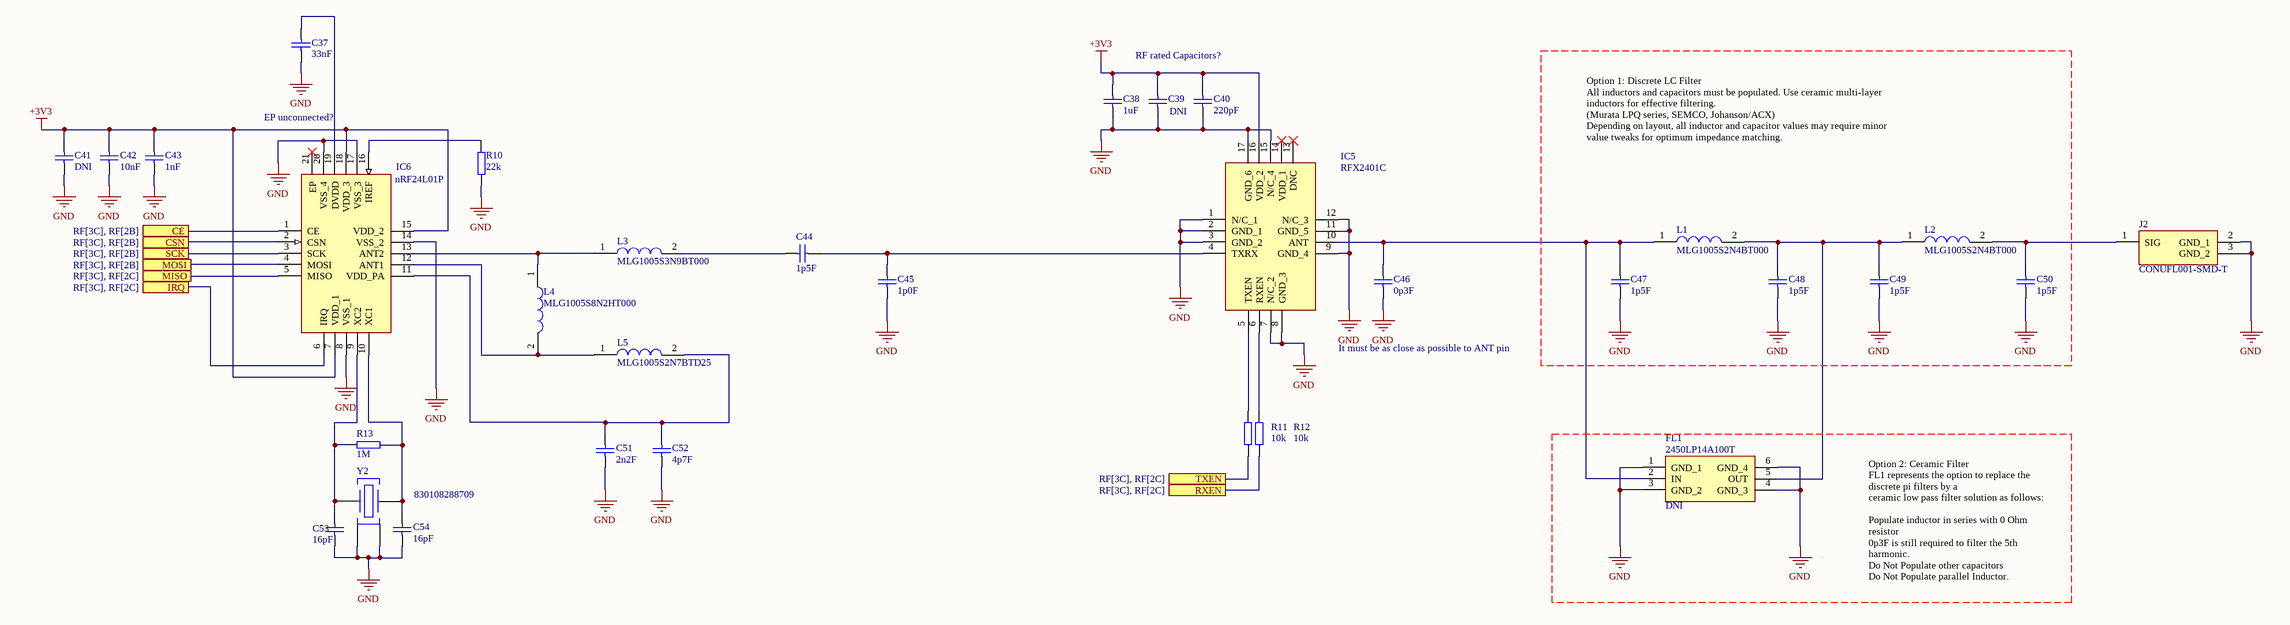
[diagram p5: NRF24l01.SchDoc]

### Parts
(Parts that share a designator on the sheet are numbered #1, #2 ... from top to bottom, then left to right.)
C37#1  value 33nF  [CAP0402]  (hidden comment: Cap0402)
C38#1  value 1uF  [CAP0402]  (hidden comment: Cap0402)
C39#1  value DNI  [CAP0402]  (hidden comment: Cap0402)
C40#1  value 220pF  [CAP0402]  (hidden comment: Cap0402)
C41#1  value DNI  [CAP0402]  (hidden comment: Cap0402)
C42#1  value 10nF  [CAP0402]  (hidden comment: Cap0402)
C43#1  value 1nF  [CAP0402]  (hidden comment: Cap0402)
C44#1  value 1p5F  [CAP0402]  (hidden comment: Cap0402)
C45#1  value 1p0F  [CAP0402]  (hidden comment: Cap0402)
C46#1  value 0p3F  [CAP0402]  (hidden comment: Cap0402)
C47#1  value 1p5F  [CAP0402]  (hidden comment: Cap0402)
C48#1  value 1p5F  [CAP0402]  (hidden comment: Cap0402)
C49#1  value 1p5F  [CAP0402]  (hidden comment: Cap0402)
C50#1  value 1p5F  [CAP0402]  (hidden comment: Cap0402)
C51#1  value 2n2F  [CAP0402]  (hidden comment: Cap0402)
C52#1  value 4p7F  [CAP0402]  (hidden comment: Cap0402)
C53  value 16pF  [CAP0402]  (hidden comment: Cap0402)
C54  value 16pF  [CAP0402]  (hidden comment: Cap0402)
FL1  2450LP14A100T  value DNI  [2450LP14A100T]
IC5  RFX2401C  [QFN50P300X300X60-17N-D]
IC6  nRF24L01P  [QFN50P400X400X95-21N-D]
J2#1  CONUFL001-SMD-T  [CONUFL001-SMD]
L1#1  MLG1005S2N4BT000  [MLG1005]
L2  MLG1005S2N4BT000  [MLG1005]
L3  MLG1005S3N9BT000  [MLG1005]
L4  MLG1005S8N2HT000  [MLG1005]
L5  MLG1005S2N7BTD25  [MLG1005]
R10#1  value 22k  [RES0402]  (hidden comment: Res0402)
R11#1  value 10k  [RES0402]  (hidden comment: Res0402)
R12#1  value 10k  [RES0402]  (hidden comment: Res0402)
R13#1  value 1M  [RES0402]  (hidden comment: Res0402)
Y2  830108288709  [830108288709]

### Ports
CE (see RF[3C], RF[2B]), CSN (see RF[3C], RF[2B]), IRQ (see RF[3C], RF[2C]), MISO (see RF[3C], RF[2C]), MOSI (see RF[3C], RF[2B]), RXEN (see RF[3C], RF[2C]), SCK (see RF[3C], RF[2B]), TXEN (see RF[3C], RF[2C])

### Nets
+3V3: C38#1.2 C39#1.2 C40#1.2 C41#1.2 C42#1.2 C43#1.2 IC5.16(VDD_2) IC6.7(VDD_1) IC6.15(VDD_2) IC6.18(VDD_3)
GND: C37#1.1 C38#1.1 C39#1.1 C40#1.1 C41#1.1 C42#1.1 C43#1.1 C45#1.1 C46#1.1 C47#1.1 C48#1.1 C49#1.1 C50#1.1 C51#1.1 C52#1.1 C53.1 C54.1 FL1.1(GND_1) FL1.3(GND_2) FL1.4(GND_3) FL1.6(GND_4) IC5.1(N/C_1) IC5.2(GND_1) IC5.3(GND_2) IC5.7(N/C_2) IC5.8(GND_3) IC5.9(GND_4) IC5.11(GND_5) IC5.12(N/C_3) IC5.15(N/C_4) IC5.17(GND_6) IC6.8(VSS_1) IC6.14(VSS_2) IC6.17(VSS_3) IC6.20(VSS_4) J2#1.2(GND_1) J2#1.3(GND_2) R10#1.1 Y2.2(GND_1) Y2.4(GND_2)
NetC37#1_2: C37#1.2 IC6.19(DVDD)
NetC44#1_1: C44#1.1 C45#1.2 IC5.4(TXRX)
NetC44#1_2: C44#1.2 L3.2
NetC46#1_2: C46#1.2 C47#1.2 FL1.2(IN) IC5.10(ANT) L1#1.1
NetC48#1_2: C48#1.2 C49#1.2 FL1.5(OUT) L1#1.2 L2.1
NetC50#1_2: C50#1.2 J2#1.1(SIG) L2.2
NetC51#1_2: C51#1.2 C52#1.2 IC6.11(VDD_PA) L5.2
NetC53_2: C53.2 IC6.9(XC2) R13#1.1 Y2.1(CRYSTAL_1)
NetC54_2: C54.2 IC6.10(XC1) R13#1.2 Y2.3(CRYSTAL_2)
NetIC4#1_110: IC6.1(CE) ; port CE
NetIC4#1_111: IC6.3(SCK) ; port SCK
NetIC4#1_112: IC6.5(MISO) ; port MISO
NetIC4#1_113: IC6.4(MOSI) ; port MOSI
NetIC4#1_114: IC6.2(CSN) ; port CSN
NetIC4#1_115: IC6.6(IRQ) ; port IRQ
NetIC4#1_116: R11#1.1 ; port TXEN
NetIC4#1_117: R12#1.1 ; port RXEN
NetIC5_5: IC5.5(TXEN) R11#1.2
NetIC5_6: IC5.6(RXEN) R12#1.2
NetIC6_12: IC6.12(ANT1) L4.2 L5.1
NetIC6_13: IC6.13(ANT2) L3.1 L4.1
NetIC6_16: IC6.16(IREF) R10#1.2

Not connected (* = marked no-connect by the designer): IC5 13(DNC)* 14(VDD_1)*; IC6 21(EP)*

### Notes on the sheet
- RF rated Capacitors?
- EP unconnected?
- Option 1: Discrete LC Filter
  All inductors and capacitors must be populated. Use ceramic multi-layer
  inductors for effective filtering.
  (Murata LPQ series, SEMCO, Johanson/ACX)
  Depending on layout, all inductor and capacitor values may require minor
  value tweaks for optimum impedance matching.
- It must be as close as possible to ANT pin
- Type @ to refer to a designator
- Option 2: Ceramic Filter
  FL1 represents the option to replace the discrete pi filters by a
  ceramic low pass filter solution as follows:
  Populate inductor in series with 0 Ohm resistor
  0p3F is still required to filter the 5th harmonic.
  Do Not Populate other capacitors
  Do Not Populate parallel Inductor.

### Library data of the parts
C37#1 C38#1 C39#1 C40#1 C41#1 C42#1 C43#1 = Cap0402: Voltage: 6V3
C44#1 C45#1 C46#1 C47#1 C48#1 C49#1 C50#1 C51#1 C52#1 = Cap0402: RF NP0; Voltage: 6V3
C53 C54 = Cap0402: NP0; Voltage: 6V3
FL1 = 2450LP14A100T: Filter; Manufacturer_Name: JOHANSON TECHNOLOGY; Datasheet Link: https://componentsearchengine.com/Datasheets/1/2450LP14A100T.pdf; Height: 0.7mm; Manufacturer_Part_Number: 2450LP14A100T; Arrow Part Number: 2450LP14A100T; Arrow Price/Stock: https://www.arrow.com/en/products/2450lp14a100t/johanson-dielectrics?region=nac
IC5 = RFX2401C: Integrated Circuit; Manufacturer_Name: Skyworks; Datasheet Link: https://eu.mouser.com/datasheet/2/472/RFX2401C_204359B-1524606.pdf; Height: 0.6mm; Manufacturer_Part_Number: RFX2401C; Arrow Part Number: RFX2401C; Arrow Price/Stock: https://www.arrow.com/en/products/rfx2401c/skyworks-solutions?region=nac
IC6 = nRF24L01P: Integrated Circuit; Manufacturer_Name: Nordic Semiconductor; Height: 0.95mm; Manufacturer_Part_Number: nRF24L01P
J2#1 = CONUFL001-SMD-T: Connector; Manufacturer_Name: Linx Technologies; Datasheet Link: https://linxtechnologies.com/wp/product/mhf-rf-connectors/; Manufacturer_Part_Number: CONUFL001-SMD-T; Mouser Part Number: 712-CONUFL001-SMD-T; Mouser Price/Stock: https://www.mouser.co.uk/ProductDetail/Linx-Technologies/CONUFL001-SMD-T?qs=EU6FO9ffTwfRdkBeQTdJWQ%3D%3D
L1#1 L2 = MLG1005S2N4BT000: Inductor; Manufacturer_Name: TDK; Datasheet Link: https://product.tdk.com/system/files/dam/doc/product/inductor/inductor/smd/catalog/inductor_commercial_high-frequency_mlg1005s_en.pdf; Manufacturer_Part_Number: MLG1005S2N4BT000; Arrow Part Number: MLG1005S2N4BT000; Arrow Price/Stock: https://www.arrow.com/en/products/mlg1005s2n4bt000/tdk
L3 = MLG1005S3N9BT000: Inductor; Manufacturer_Name: TDK; Datasheet Link: https://product.tdk.com/system/files/dam/doc/product/inductor/inductor/smd/catalog/inductor_commercial_high-frequency_mlg1005s_en.pdf; Manufacturer_Part_Number: MLG1005S3N9BT000; Arrow Part Number: MLG1005S3N9BT000; Arrow Price/Stock: https://www.arrow.com/en/products/mlg1005s3n9bt000/tdk
L4 = MLG1005S8N2HT000: Inductor; Manufacturer_Name: TDK; Datasheet Link: https://product.tdk.com/system/files/dam/doc/product/inductor/inductor/smd/catalog/inductor_commercial_high-frequency_mlg1005s_en.pdf; Manufacturer_Part_Number: MLG1005S8N2HT000
L5 = MLG1005S2N7BTD25: Inductor; Manufacturer_Name: TDK; Datasheet Link: https://product.tdk.com/system/files/dam/doc/product/inductor/inductor/smd/catalog/inductor_automotive_high-frequency_mlg1005s_en.pdf; Manufacturer_Part_Number: MLG1005S2N7BTD25
Y2 = 830108288709: Crystal or Oscillator; Manufacturer_Name: Wurth Elektronik; Datasheet Link: https://www.we-online.com/catalog/datasheet/830108340709.pdf; Height: 0.5mm; Manufacturer_Part_Number: 830108288709

## Sheet ESC.SchDoc
size A3; SheetNumber: 4; SheetTotal: 7
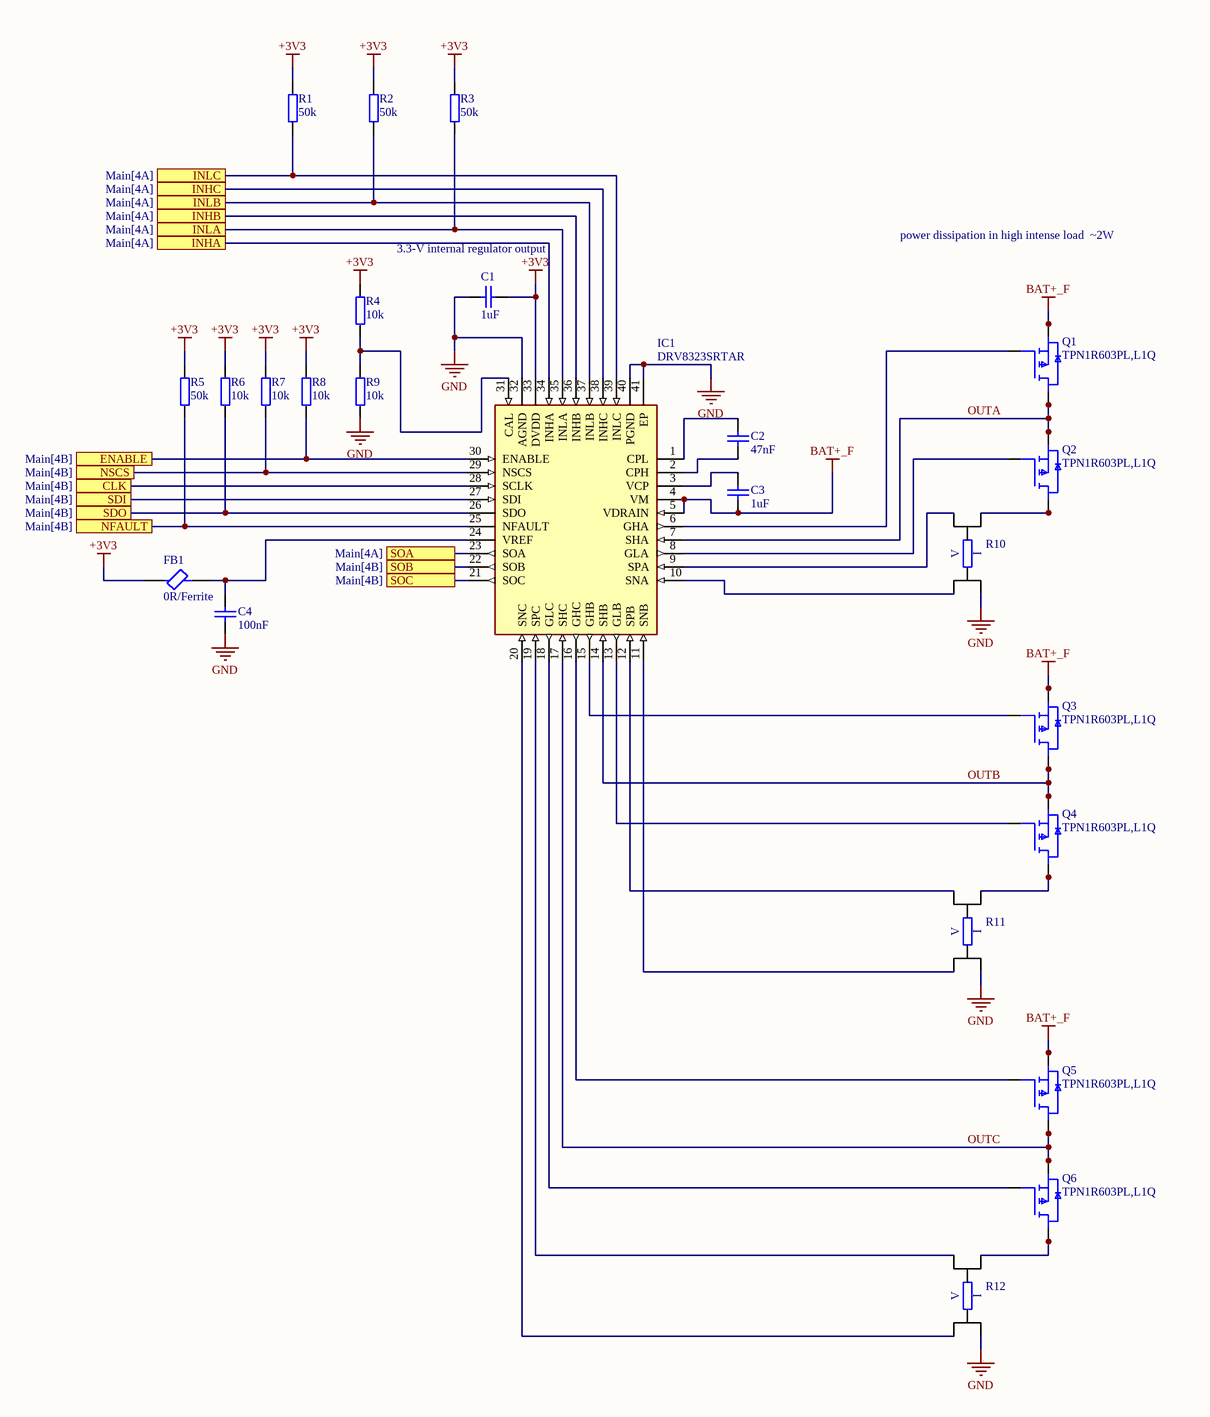
[diagram p6: ESC.SchDoc]

### Parts
(Parts that share a designator on the sheet are numbered #1, #2 ... from top to bottom, then left to right.)
C1#2  value 1uF  [CAP0402]  (hidden comment: Cap0402)
C2#2  value 47nF  [CAP0603]  (hidden comment: CapSMD0603)
C3#2  value 1uF  [CAP0603]  (hidden comment: CapSMD0603)
C4#2  value 100nF  [CAP0402]  (hidden comment: Cap0402)
FB1#2  0R/Ferrite  [NFZ15SG152SN10B]
IC1#2  DRV8323SRTAR  [QFN50P600X600X80-41N-D]
Q1#1  TPN1R603PL,L1Q  [TPN1R603PLL1Q]
Q2#1  TPN1R603PL,L1Q  [TPN1R603PLL1Q]
Q3#1  TPN1R603PL,L1Q  [TPN1R603PLL1Q]
Q4#1  TPN1R603PL,L1Q  [TPN1R603PLL1Q]
Q5#1  TPN1R603PL,L1Q  [TPN1R603PLL1Q]
Q6  TPN1R603PL,L1Q  [TPN1R603PLL1Q]
R1#2  value 50k  [RES0402]  (hidden comment: Res0402)
R2#2  value 50k  [RES0402]  (hidden comment: Res0402)
R3#2  value 50k  [RES0402]  (hidden comment: Res0402)
R4#2  value 10k  [RES0402]  (hidden comment: Res0402)
R5#2  value 50k  [RES0402]  (hidden comment: Res0402)
R6#2  value 10k  [RES0402]  (hidden comment: Res0402)
R7#2  value 10k  [RES0402]  (hidden comment: Res0402)
R8#2  value 10k  [RES0402]  (hidden comment: Res0402)
R9#2  value 10k  [RES0402]  (hidden comment: Res0402)
R10#2  WSK12161L000FEA  [WSK12161L000FEA]  (value not drawn)
R11#2  WSK12161L000FEA  [WSK12161L000FEA]  (value not drawn)
R12#2  WSK12161L000FEA  [WSK12161L000FEA]  (value not drawn)

### Ports
CLK (see Main[4B]), ENABLE (see Main[4B]), INHA (see Main[4A]), INHB (see Main[4A]), INHC (see Main[4A]), INLA (see Main[4A]), INLB (see Main[4A]), INLC (see Main[4A]), NFAULT (see Main[4B]), NSCS (see Main[4B]), SDI (see Main[4B]), SDO (see Main[4B]), SOA (see Main[4A]), SOB (see Main[4B]), SOC (see Main[4B])

### Nets
+3V3: C1#2.2 FB1#2.1 IC1#2.33(DVDD) R1#2.2 R2#2.2 R3#2.2 R4#2.2 R5#2.2 R6#2.2 R7#2.2 R8#2.2
BAT+_F: C3#2.1 IC1#2.4(VM) IC1#2.5(VDRAIN) Q1#1.1(S_1) Q1#1.2(S_2) Q1#1.3(S_3) Q3#1.1(S_1) Q3#1.2(S_2) Q3#1.3(S_3) Q5#1.1(S_1) Q5#1.2(S_2) Q5#1.3(S_3)
GND: C1#2.1 C4#2.1 IC1#2.32(AGND) IC1#2.40(PGND) IC1#2.41(EP) R9#2.1 R10#2.1 R11#2.1 R12#2.1
OUTA: IC1#2.7(SHA) Q1#1.5(D_1) Q1#1.6(D_2) Q1#1.7(D_3) Q1#1.8(D_4) Q1#1.9(D_4) Q2#1.1(S_1) Q2#1.2(S_2) Q2#1.3(S_3)
OUTB: IC1#2.14(SHB) Q3#1.5(D_1) Q3#1.6(D_2) Q3#1.7(D_3) Q3#1.8(D_4) Q3#1.9(D_4) Q4#1.1(S_1) Q4#1.2(S_2) Q4#1.3(S_3)
OUTC: IC1#2.17(SHC) Q5#1.5(D_1) Q5#1.6(D_2) Q5#1.7(D_3) Q5#1.8(D_4) Q5#1.9(D_4) Q6.1(S_1) Q6.2(S_2) Q6.3(S_3)
NetC2#2_1: C2#2.1 IC1#2.2(CPH)
NetC2#2_2: C2#2.2 IC1#2.1(CPL)
NetC3#2_2: C3#2.2 IC1#2.3(VCP)
NetC4#2_2: C4#2.2 FB1#2.2 IC1#2.24(VREF)
NetIC1#2_6: IC1#2.6(GHA) Q1#1.4(G)
NetIC1#2_8: IC1#2.8(GLA) Q2#1.4(G)
NetIC1#2_9: IC1#2.9(SPA) R10#2.3
NetIC1#2_10: IC1#2.10(SNA) R10#2.2
NetIC1#2_11: IC1#2.11(SNB) R11#2.2
NetIC1#2_12: IC1#2.12(SPB) R11#2.3
NetIC1#2_13: IC1#2.13(GLB) Q4#1.4(G)
NetIC1#2_15: IC1#2.15(GHB) Q3#1.4(G)
NetIC1#2_16: IC1#2.16(GHC) Q5#1.4(G)
NetIC1#2_18: IC1#2.18(GLC) Q6.4(G)
NetIC1#2_19: IC1#2.19(SPC) R12#2.3
NetIC1#2_20: IC1#2.20(SNC) R12#2.2
NetIC1#2_21: IC1#2.21(SOC) ; port SOC
NetIC1#2_22: IC1#2.22(SOB) ; port SOB
NetIC1#2_23: IC1#2.23(SOA) ; port SOA
NetIC1#2_25: IC1#2.25(NFAULT) R5#2.1 ; port NFAULT
NetIC1#2_26: IC1#2.26(SDO) R6#2.1 ; port SDO
NetIC1#2_27: IC1#2.27(SDI) ; port SDI
NetIC1#2_28: IC1#2.28(SCLK) ; port CLK
NetIC1#2_29: IC1#2.29(NSCS) R7#2.1 ; port NSCS
NetIC1#2_30: IC1#2.30(ENABLE) R8#2.1 ; port ENABLE
NetIC1#2_31: IC1#2.31(CAL) R4#2.1 R9#2.2
NetIC1#2_34: IC1#2.34(INHA) ; port INHA
NetIC1#2_35: IC1#2.35(INLA) R3#2.1 ; port INLA
NetIC1#2_36: IC1#2.36(INHB) ; port INHB
NetIC1#2_37: IC1#2.37(INLB) R2#2.1 ; port INLB
NetIC1#2_38: IC1#2.38(INHC) ; port INHC
NetIC1#2_39: IC1#2.39(INLC) R1#2.1 ; port INLC
NetQ2#1_5: Q2#1.5(D_1) Q2#1.6(D_2) Q2#1.7(D_3) Q2#1.8(D_4) Q2#1.9(D_4) R10#2.4
NetQ4#1_5: Q4#1.5(D_1) Q4#1.6(D_2) Q4#1.7(D_3) Q4#1.8(D_4) Q4#1.9(D_4) R11#2.4
NetQ6_5: Q6.5(D_1) Q6.6(D_2) Q6.7(D_3) Q6.8(D_4) Q6.9(D_4) R12#2.4

### Notes on the sheet
- power dissipation in high intense load  ~2W
- 3.3-V internal regulator output
- (near IC1#2) Separate grounds?
- (in symbol WSK1216L5000FEA) I; V

### Library data of the parts
C1#2 = Cap0402: Voltage: val
C2#2 C3#2 = CapSMD0603: 50V; Published: 8-Jun-2000; LatestRevisionDate: 29-May-2009; LatestRevisionNote: IPC-7351 Footprint Added.; PackageReference: C1206; Publisher: Altium Limited; PackageDescription: Chip Capacitor
C4#2 = Cap0402: Voltage: 6V3
FB1#2 = BLM15PE471SH1D: as FB1#1 on sheet MCU; Datasheet Link: https://www.murata.com/en-global/products/productdetail.aspx?cate=luNoiseSupprFilteChipFerriBead&partno=BLM15PE471SH1%23; Height: 0.55mm; Manufacturer_Part_Number: BLM15PE471SH1D; Mouser Part Number: 81-BLM15PE471SH1D; Mouser Price/Stock: https://www.mouser.co.uk/ProductDetail/Murata-Electronics/BLM15PE471SH1D?qs=DRkmTr78QATAY5qAVx1hGA%3D%3D
IC1#2 = DRV8323SRTAR: Integrated Circuit; Manufacturer_Name: Texas Instruments; Datasheet Link: http://www.ti.com/lit/ds/symlink/drv8323.pdf; Height: 0.8mm; Manufacturer_Part_Number: DRV8323SRTAR; Mouser Part Number: 595-DRV8323SRTAR; Mouser Price/Stock: https://www.mouser.co.uk/ProductDetail/Texas-Instruments/DRV8323SRTAR?qs=u4fy%2FsgLU9P2gpPTX6mffg%3D%3D; Arrow Part Number: DRV8323SRTAR; Arrow Price/Stock: https://www.arrow.com/en/products/drv8323srtar/texas-instruments?utm_currency=USD&region=nac
Q1#1 Q2#1 Q3#1 Q4#1 Q5#1 Q6 = TPN1R603PL,L1Q: MOSFET (N-Channel); Manufacturer_Name: Toshiba; Datasheet Link: https://toshiba.semicon-storage.com/ap-en/semiconductor/product/mosfets/12v-300v-mosfets/detail.TPN1R603PL.html; Height: 0.9mm; Manufacturer_Part_Number: TPN1R603PL,L1Q; Mouser Part Number: 757-TPN1R603PLL1Q; Mouser Price/Stock: https://www.mouser.co.uk/ProductDetail/Toshiba/TPN1R603PLL1Q?qs=bUPhaerQQeGYpGlYi%252BLguw%3D%3D; Arrow Part Number: TPN1R603PL,L1Q; Arrow Price/Stock: https://www.arrow.com/en/products/tpn1r603pll1q/toshiba?utm_currency=USD&region=nac
R10#2 R11#2 R12#2 = WSK1216L5000FEA: Resistor; Manufacturer_Name: Vishay; Datasheet Link: http://www.vishay.com/docs/30189/wsk1216.pdf; Height: 1.9mm; Manufacturer_Part_Number: WSK1216L5000FEA; Mouser Part Number: 71-WSK1216L5000FEA; Mouser Price/Stock: https://www.mouser.co.uk/ProductDetail/Vishay-Dale/WSK1216L5000FEA?qs=OlC7AqGiEDlM2wGD42LFoQ%3D%3D; Arrow Part Number: WSK1216L5000FEA; Arrow Price/Stock: https://www.arrow.com/en/products/wsk1216l5000fea/vishay?region=nac

## Sheet USB.SchDoc
size A4; SheetNumber: 4; SheetTotal: 10
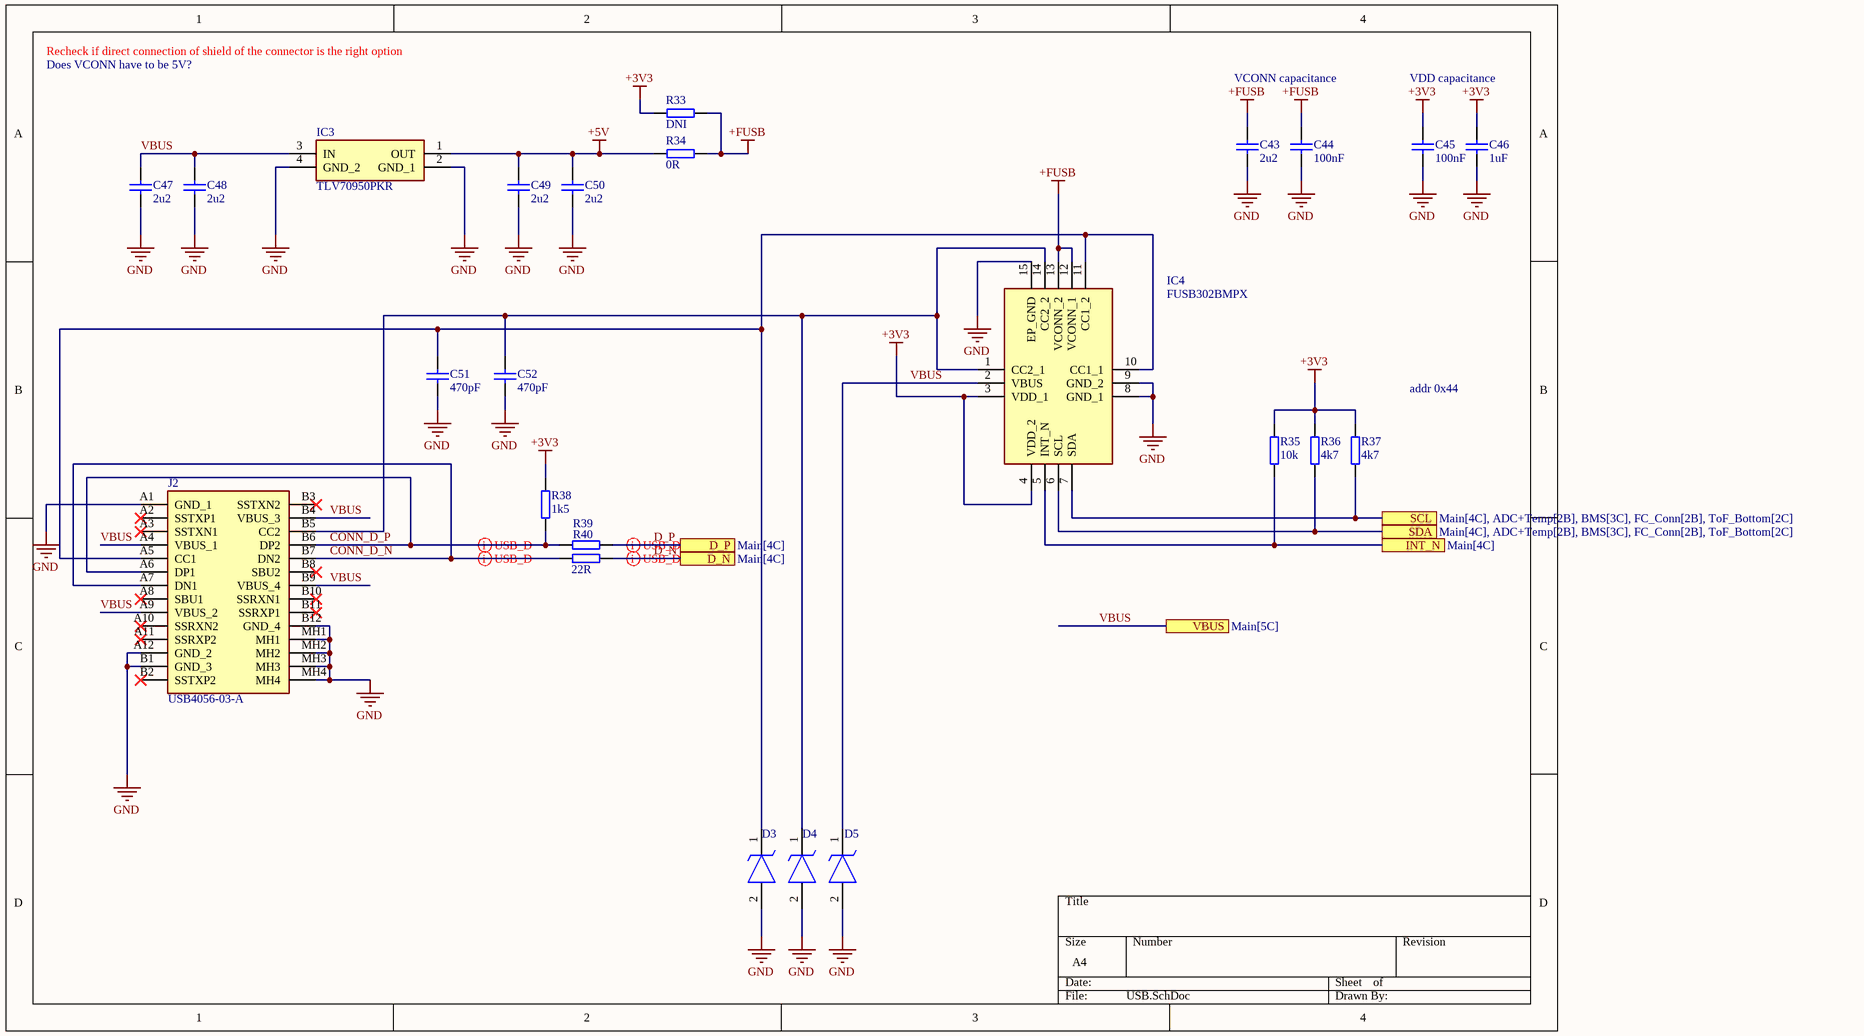
[diagram p7: USB.SchDoc]

### Parts
(Parts that share a designator on the sheet are numbered #1, #2 ... from top to bottom, then left to right.)
C43#2  value 2u2  [CAP0603]  (hidden comment: Cap0603)
C44#2  value 100nF  [CAP0402]  (hidden comment: Cap0402)
C45#2  value 100nF  [CAP0402]  (hidden comment: Cap0402)
C46#2  value 1uF  [CAP0402]  (hidden comment: Cap0402)
C47#2  value 2u2  [CAP0603]  (hidden comment: Cap0603)
C48#2  value 2u2  [CAP0603]  (hidden comment: Cap0603)
C49#2  value 2u2  [CAP0603]  (hidden comment: Cap0603)
C50#2  value 2u2  [CAP0603]  (hidden comment: Cap0603)
C51#2  value 470pF  [CAP0402]  (hidden comment: Cap0402)
C52#2  value 470pF  [CAP0402]  (hidden comment: Cap0402)
D3#2  D1213A-01LP4-7B  [D1213A01LP47B]  (value not drawn)
D4#2  D1213A-01LP4-7B  [D1213A01LP47B]  (value not drawn)
D5#2  DF2S24FS,L3M  [SODFL1006X45N]  (value not drawn)
IC3#2  TLV70950PKR  [TL431AQPKG3]
IC4#2  FUSB302BMPX  [QFN50P250X250X80-15N]
J2#2  USB4056-03-A  [USB405603A]
R33  value DNI  [RES0402]  (hidden comment: Res0402)
R34  value 0R  [RES0402]  (hidden comment: Res0402)
R35  value 10k  [RES0402]  (hidden comment: Res0402)
R36  value 4k7  [RES0402]  (hidden comment: Res0402)
R37  value 4k7  [RES0402]  (hidden comment: Res0402)
R38  value 1k5  [RES0402]  (hidden comment: Res0402)
R39  Res0402  [RES0402]  (value not drawn)
R40  value 22R  [RES0402]  (hidden comment: Res0402)

### Ports
D_N (see Main[4C]), D_P (see Main[4C]), INT_N (see Main[4C]), SCL (see Main[4C], ADC+Temp[2B], BMS[3C], FC_Conn[2B], ToF_Bottom[2C]), SDA (see Main[4C], ADC+Temp[2B], BMS[3C], FC_Conn[2B], ToF_Bottom[2C]), VBUS (see Main[5C])

### Nets
+3V3: C45#2.2 C46#2.2 IC4#2.3(VDD_1) IC4#2.4(VDD_2) R33.2 R35.2 R36.2 R37.2 R38.2
+5V: C49#2.2 C50#2.2 IC3#2.1(OUT) R34.2
+FUSB: C43#2.2 C44#2.2 IC4#2.12(VCONN_1) IC4#2.13(VCONN_2) R33.1 R34.1
GND: C43#2.1 C44#2.1 C45#2.1 C46#2.1 C47#2.1 C48#2.1 C49#2.1 C50#2.1 C51#2.1 C52#2.1 D3#2.2(A) D4#2.2(A) D5#2.2(A) IC3#2.2(GND_1) IC3#2.4(GND_2) IC4#2.8(GND_1) IC4#2.9(GND_2) IC4#2.15(EP_GND) J2#2.A1(GND_1) J2#2.A12(GND_2) J2#2.B1(GND_3) J2#2.B12(GND_4) J2#2.MH1 J2#2.MH2 J2#2.MH3 J2#2.MH4
CONN_D_N: J2#2.A7(DN1) J2#2.B7(DN2) R40.1
CONN_D_P: J2#2.A6(DP1) J2#2.B6(DP2) R38.1 R39.1
D_N: R40.2 ; port D_N
D_P: R39.2 ; port D_P
VBUS: C47#2.2 C48#2.2 D5#2.1(K) IC3#2.3(IN) IC4#2.2(VBUS) J2#2.A4(VBUS_1) J2#2.A9(VBUS_2) J2#2.B4(VBUS_3) J2#2.B9(VBUS_4) ; port VBUS
NetC51#2_2: C51#2.2 D3#2.1(K) IC4#2.10(CC1_1) IC4#2.11(CC1_2) J2#2.A5(CC1)
NetC52#2_2: C52#2.2 D4#2.1(K) IC4#2.1(CC2_1) IC4#2.14(CC2_2) J2#2.B5(CC2)
NetIC4#2_5: IC4#2.5(INT_N) R35.1 ; port INT_N
NetIC4#2_6: IC4#2.6(SCL) R36.1 ; port SDA
NetIC4#2_7: IC4#2.7(SDA) R37.1 ; port SCL

Not connected (* = marked no-connect by the designer): J2#2 A2(SSTXP1)* A3(SSTXN1)* A8(SBU1)* A10(SSRXN2)* A11(SSRXP2)* B2(SSTXP2)* B3(SSTXN2)* B8(SBU2)* B10(SSRXN1)* B11(SSRXP1)*

### Layout directives
differential pair: CONN_D_N, CONN_D_P, D_N, D_P

### Notes on the sheet
- Recheck if direct connection of shield of the connector is the right option
- Does VCONN have to be 5V?
- VCONN capacitance
- VDD capacitance
- addr 0x44

### Library data of the parts
C43#2 C47#2 C48#2 C49#2 C50#2 = Cap0603: Voltage: 50V
C44#2 C45#2 C46#2 = Cap0402: Voltage: 6V3
C51#2 C52#2 = Cap0402: Voltage: val
D3#2 D4#2 = D1213A-01LP4-7B: as D1 on sheet MCU; Datasheet Link: https://www.diodes.com/assets/Datasheets/D1213A-01LP4.pdf; Height: 0.4mm; Manufacturer_Part_Number: D1213A-01LP4-7B; Mouser Part Number: 621-D1213A-01LP4-7B; Mouser Price/Stock: https://www.mouser.co.uk/ProductDetail/Diodes-Incorporated/D1213A-01LP4-7B?qs=gfe7vQ8txpVKfG5NOSOvfA%3D%3D; Arrow Part Number: D1213A-01LP4-7B; Arrow Price/Stock: https://www.arrow.com/en/products/d1213a-01lp4-7b/diodes-incorporated?region=europe
D5#2 = DF2S24FS,L3M: TVS Diode (Uni-directional); Manufacturer_Name: Toshiba; Datasheet Link: https://www.mouser.com/datasheet/2/408/DF2S24FS_datasheet_en_20140718-708374.pdf; Height: 0.45mm; Manufacturer_Part_Number: DF2S24FS,L3M; Mouser Part Number: 757-DF2S24FSL3M; Mouser Price/Stock: https://www.mouser.co.uk/ProductDetail/Toshiba/DF2S24FSL3M?qs=lhkzy8lC%252BSvG2umxl0FuEw%3D%3D; Arrow Part Number: DF2S24FS,L3M; Arrow Price/Stock: https://www.arrow.com/en/products/df2s24fsl3m/toshiba?region=nac
IC3#2 = TLV70950PKR: Integrated Circuit; Manufacturer_Name: Texas Instruments; Datasheet Link: https://www.ti.com/lit/gpn/tlv709; Height: 1.6mm; Manufacturer_Part_Number: TLV70950PKR; Mouser Part Number: 595-TLV70950PKR; Mouser Price/Stock: https://www.mouser.co.uk/ProductDetail/Texas-Instruments/TLV70950PKR?qs=dbcCsuKDzFU3yYGsVf2izQ%3D%3D; Arrow Part Number: TLV70950PKR; Arrow Price/Stock: null?region=nac
IC4#2 = FUSB302BMPX: Integrated Circuit; Manufacturer_Name: onsemi; Datasheet Link: https://www.onsemi.com/pub/Collateral/FUSB302B-D.PDF; Height: 0.8mm; Manufacturer_Part_Number: FUSB302BMPX; Mouser Part Number: 512-FUSB302BMPX; Mouser Price/Stock: https://www.mouser.co.uk/ProductDetail/onsemi-Fairchild/FUSB302BMPX?qs=8ziscO3x5y1SHqdwooDK6g%3D%3D; Arrow Part Number: FUSB302BMPX; Arrow Price/Stock: https://www.arrow.com/en/products/fusb302bmpx/on-semiconductor?utm_currency=USD&region=nac
J2#2 = USB4056-03-A: Connector; Manufacturer_Name: GCT (GLOBAL CONNECTOR TECHNOLOGY); Datasheet Link: https://www.mouser.jp/datasheet/2/837/usb4056-2448808.pdf; Height: 3.56mm; Manufacturer_Part_Number: USB4056-03-A; Mouser Part Number: 640-USB4056-03-A; Mouser Price/Stock: https://www.mouser.co.uk/ProductDetail/GCT/USB4056-03-A?qs=QNEnbhJQKvbZ7hZzgFEugA%3D%3D
R39 = Res0402: Value: 22R

## Sheet PDN.SchDoc
size A4; SheetNumber: 3; SheetTotal: 12
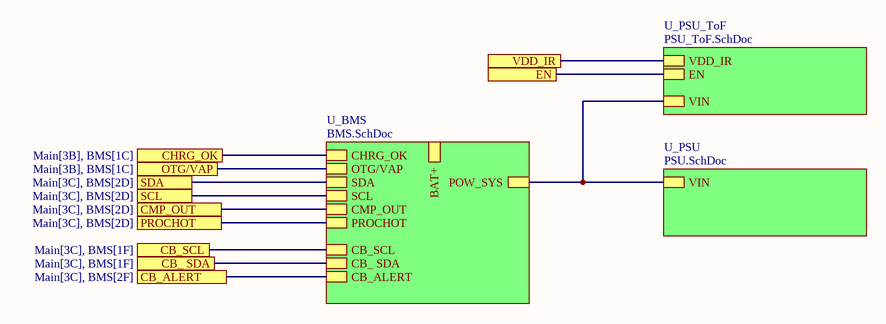
[diagram p8: PDN.SchDoc]

### Sub-sheets
U_BMS = BMS.SchDoc: CHRG_OK, OTG/VAP, SDA, SCL, CMP_OUT, PROCHOT, CB_SCL, CB_ SDA, CB_ALERT, BAT+, POW_SYS
U_PSU = PSU.SchDoc: VIN
U_PSU_ToF = PSU_ToF.SchDoc (file not in this document): VIN, VDD_IR, EN

### Ports
CB_ SDA (see Main[3C], BMS[1F]), CB_ALERT (see Main[3C], BMS[2F]), CB_SCL (see Main[3C], BMS[1F]), CHRG_OK (see Main[3B], BMS[1C]), CMP_OUT (see Main[3C], BMS[2D]), EN, OTG/VAP (see Main[3B], BMS[1C]), PROCHOT (see Main[3C], BMS[2D]), SCL (see Main[3C], BMS[2D]), SDA (see Main[3C], BMS[2D]), VDD_IR

### Nets
NetC5#2_1: sheet U_PSU/VIN, sheet U_BMS/POW_SYS, sheet U_PSU_ToF/VIN
NetIC1#3_4: port CHRG_OK, sheet U_BMS/CHRG_OK
NetIC1#3_5: port OTG/VAP, sheet U_BMS/OTG/VAP
NetIC1#3_11: port PROCHOT, sheet U_BMS/PROCHOT
NetIC1#3_12: port SDA, sheet U_BMS/SDA
NetIC1#3_13: port SCL, sheet U_BMS/SCL
NetIC2#2_4: port CB_ SDA, sheet U_BMS/CB_ SDA
NetIC2#2_5: port CB_SCL, sheet U_BMS/CB_SCL
NetIC2#2_20: port CB_ALERT, sheet U_BMS/CB_ALERT
(unnamed): port CMP_OUT, sheet U_BMS/CMP_OUT
(unnamed): port VDD_IR, sheet U_PSU_ToF/VDD_IR
(unnamed): port EN, sheet U_PSU_ToF/EN